# Altium project ((Inventory)).PrjPcb (part 3 of 4)

## Sheet Resistor - 681-816.SchDoc
size A0; SheetNumber: 12; SheetTotal: 41
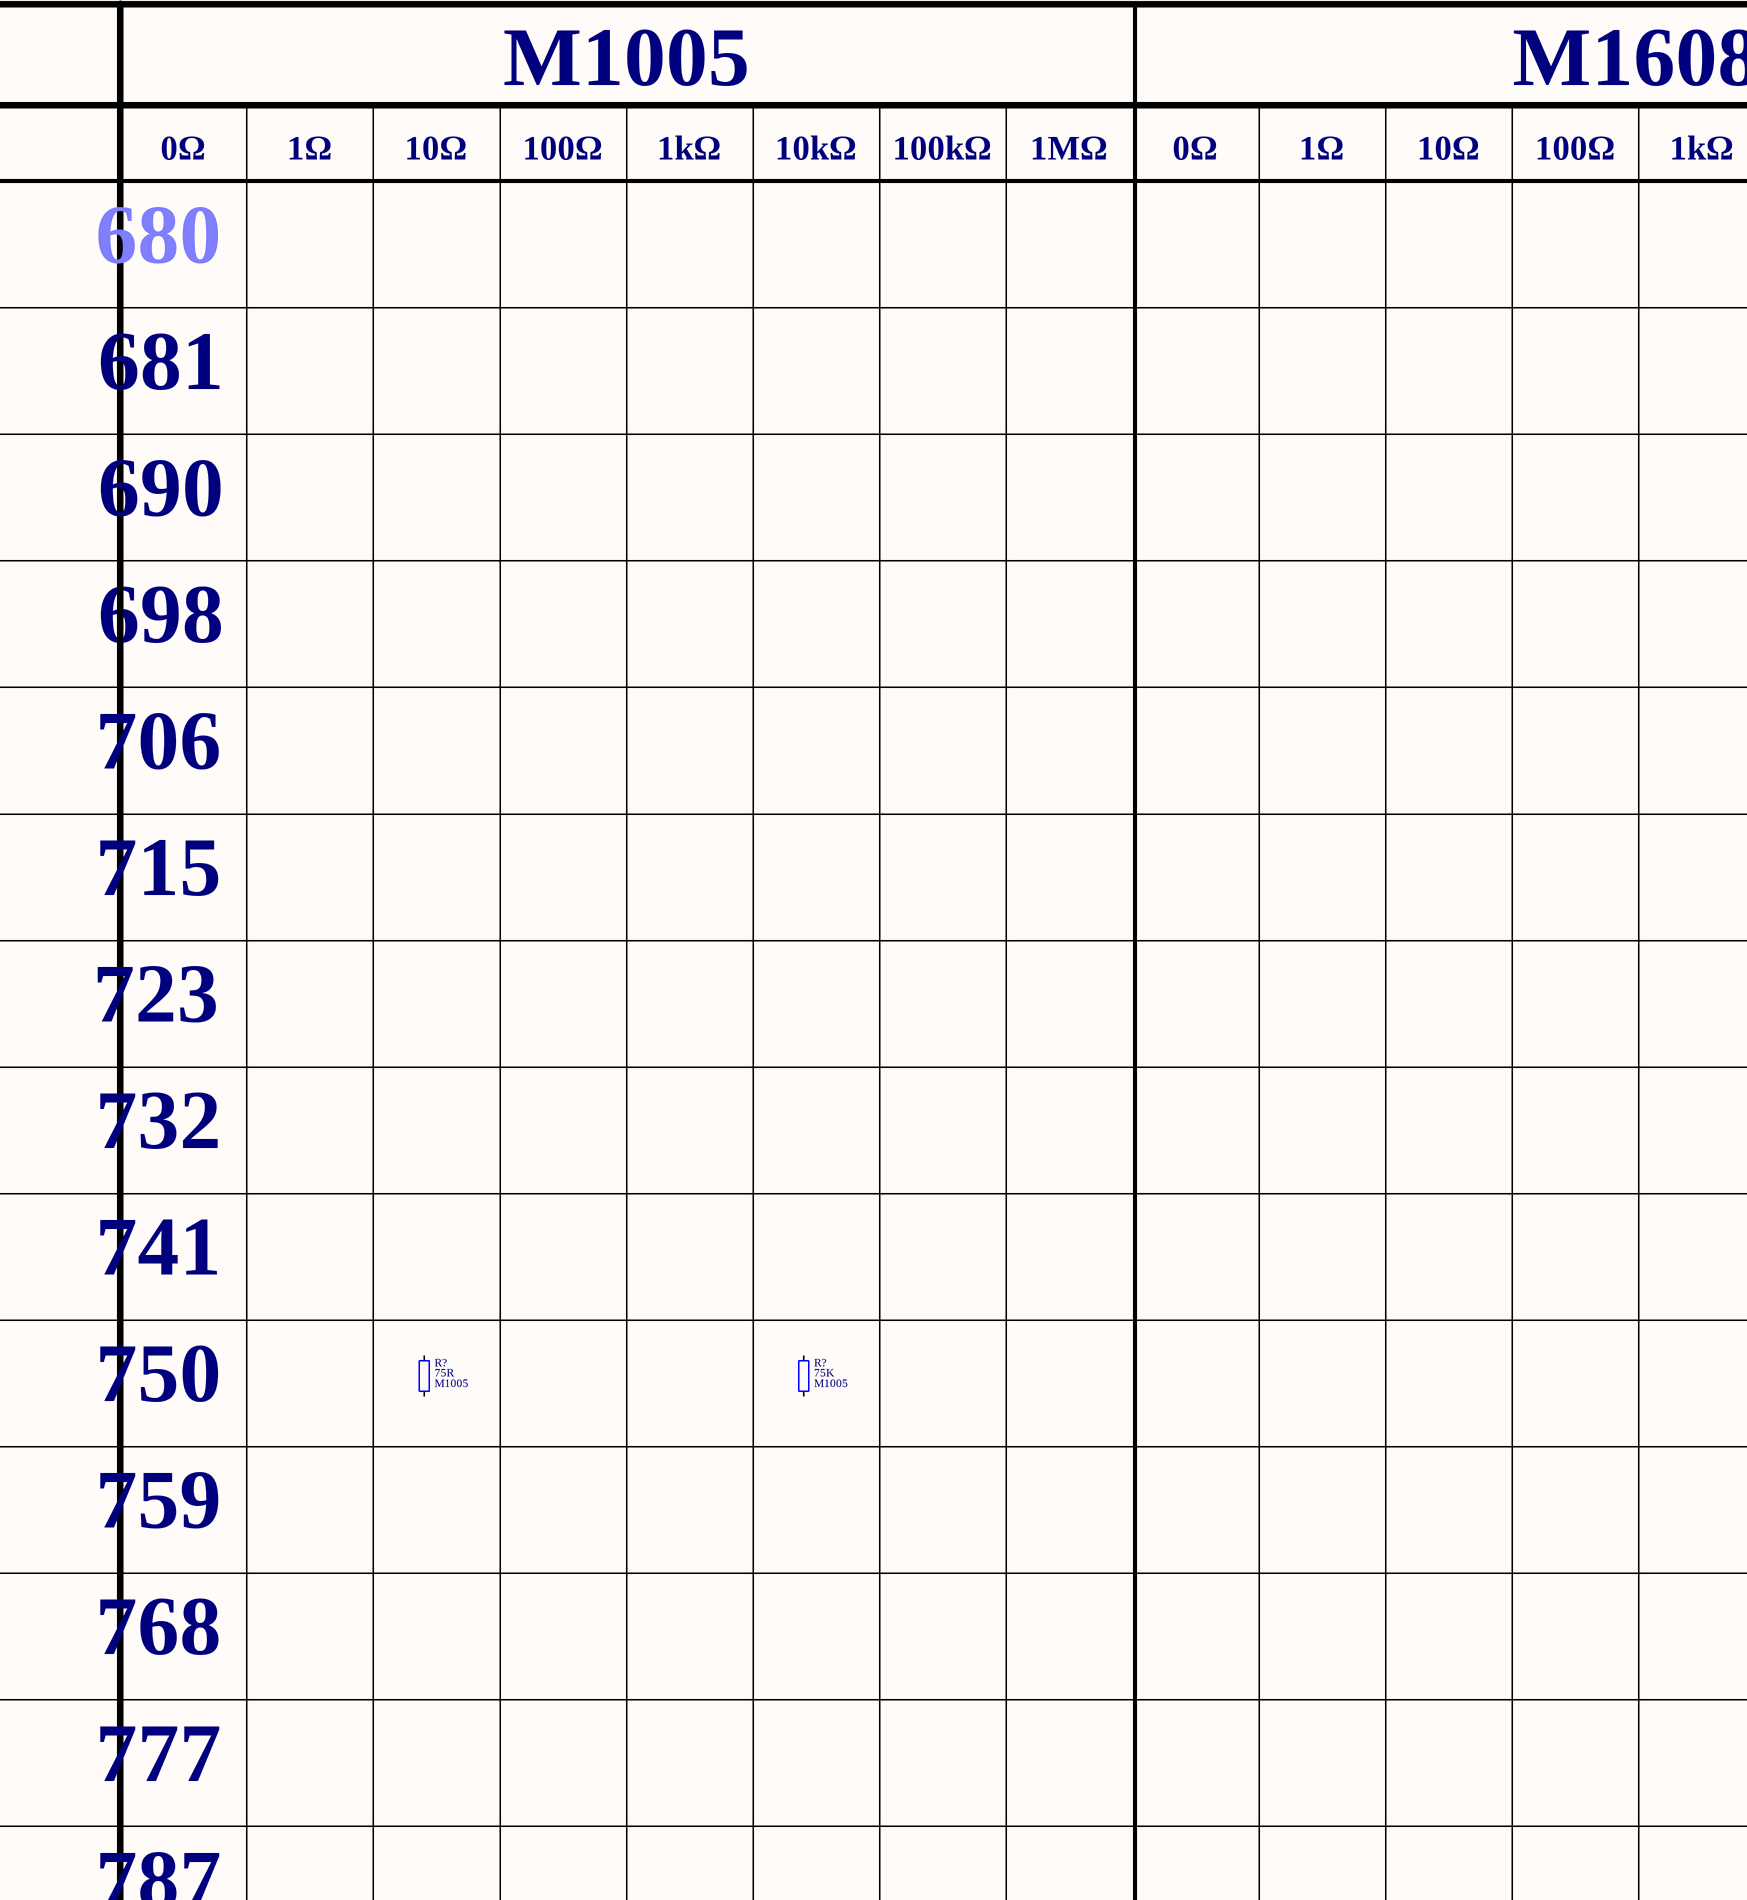
[diagram p41: Resistor - 681-816.SchDoc, top left]
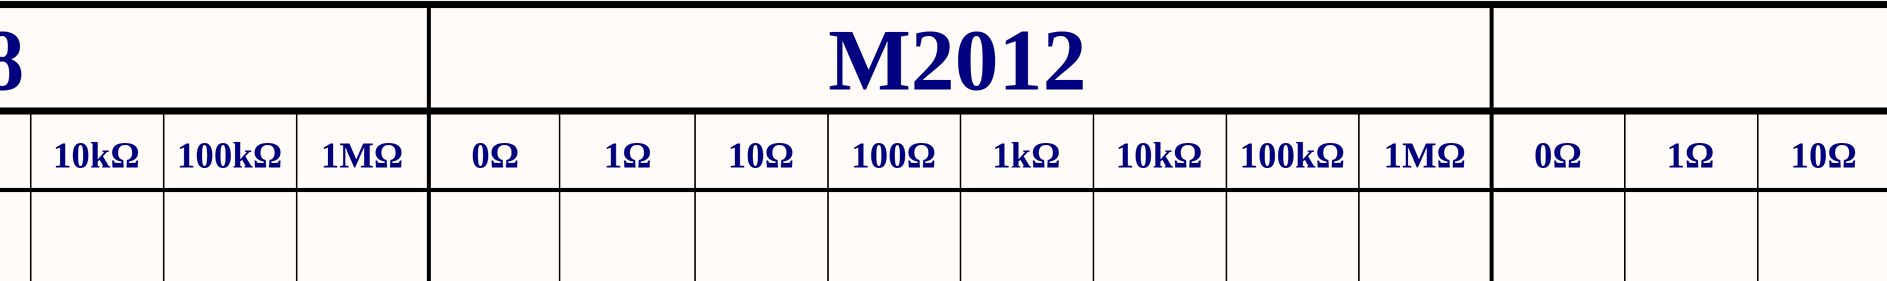
[diagram p42: Resistor - 681-816.SchDoc, top middle]
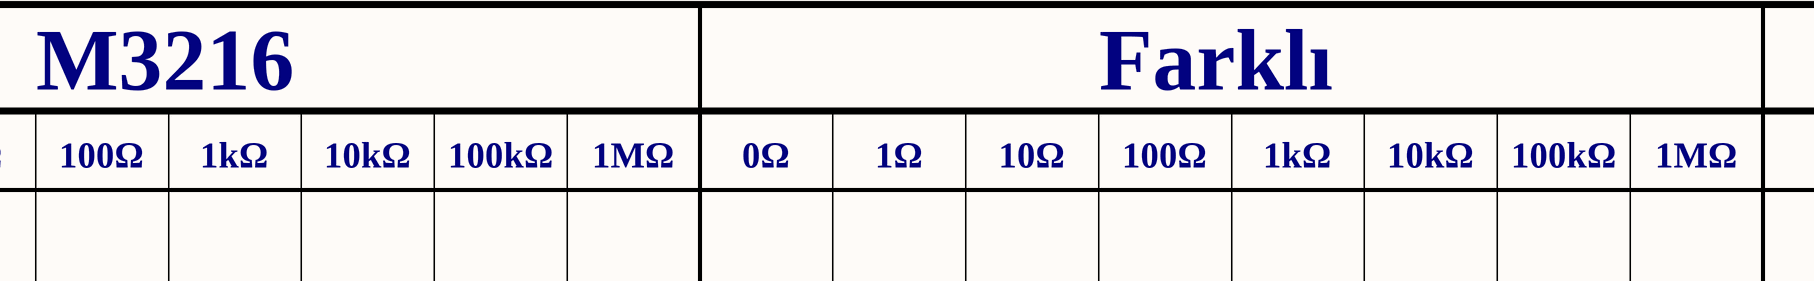
[diagram p43: Resistor - 681-816.SchDoc, top right]
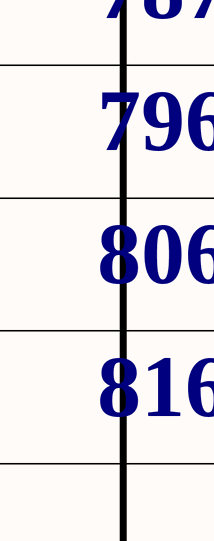
[diagram p44: Resistor - 681-816.SchDoc, bottom left]

### Parts
(Parts that share a designator on the sheet are numbered #1, #2 ... from top to bottom, then left to right.)
R?#18  value 75R  Package: M1005  [Resistor_Smd_M1005_I0402]  (hidden comment: Resistor)
R?#19  value 75K  Package: M1005  [Resistor_Smd_M1005_I0402]  (hidden comment: Resistor)

### Nets

Not connected (* = marked no-connect by the designer): R?#18 1 2; R?#19 1 2

### Notes on the sheet
- M1005
- M1608
- M2012
- M3216
- Farklı
- 0Ω
- 1Ω
- 10Ω
- 100Ω
- 1kΩ
- 10kΩ
- 100kΩ
- 1MΩ
- 680
- 681
- 690
- 698
- 706
- 715
- 723
- 732
- 741
- 750
- 759
- 768
- 777
- 787
- 796
- 806
- 816

### Library data of the parts
R?#18 = Resistor: Res, 75R, 1%, M1005; Manufacturer: Yageo; Manufacturer Part Number: RC0402FR-0775RL; Component Category: Resistor; Component Type: Fixed Value; Tolerance: 1%; Supplier Link: https://www.digikey.com/en/products/detail/yageo/RC0402FR-0775RL/726658; Supplier Currency: $; Price, Max: 0.00129; Price, Min: 0.1; Quantity, Max: 100000; Quantity, Min: 1; Operating Temperature, Max: -55℃; Operating Temperature, Min: +155℃; Supplier Part Number: 311-75.0LRCT-ND; Supplier: Digikey; ComponentLink1Description: Datasheet; ComponentLink1URL: E:\Altium\Datasheets\Resistor\Yageo - RC_L Series.pdf; ComponentLink2Description: Supplier Link; ComponentLink2URL: https://www.digikey.com/en/products/detail/yageo/RC0402FR-0775RL/726658
R?#19 = Resistor: Res, 75K, 1%, M1005; Manufacturer: Yageo; Manufacturer Part Number: RC0402FR-0775KL; Component Category: Resistor; Component Type: Fixed Value; Tolerance: 1%; Supplier Link: https://www.digikey.com/en/products/detail/yageo/RC0402FR-0775KL/2827576; Supplier Currency: $; Price, Max: 0.00129; Price, Min: 0.1; Quantity, Max: 100000; Quantity, Min: 1; Operating Temperature, Max: -55℃; Operating Temperature, Min: +155℃; Supplier Part Number: 311-75KLRCT-ND; Supplier: Digikey; ComponentLink1Description: Datasheet; ComponentLink1URL: E:\Altium\Datasheets\Resistor\Yageo - RC_L Series.pdf; ComponentLink2Description: Supplier Link; ComponentLink2URL: https://www.digikey.com/en/products/detail/yageo/RC0402FR-0775KL/2827576

## Sheet Resistor - 825-988.SchDoc
size A0; SheetNumber: 13; SheetTotal: 14
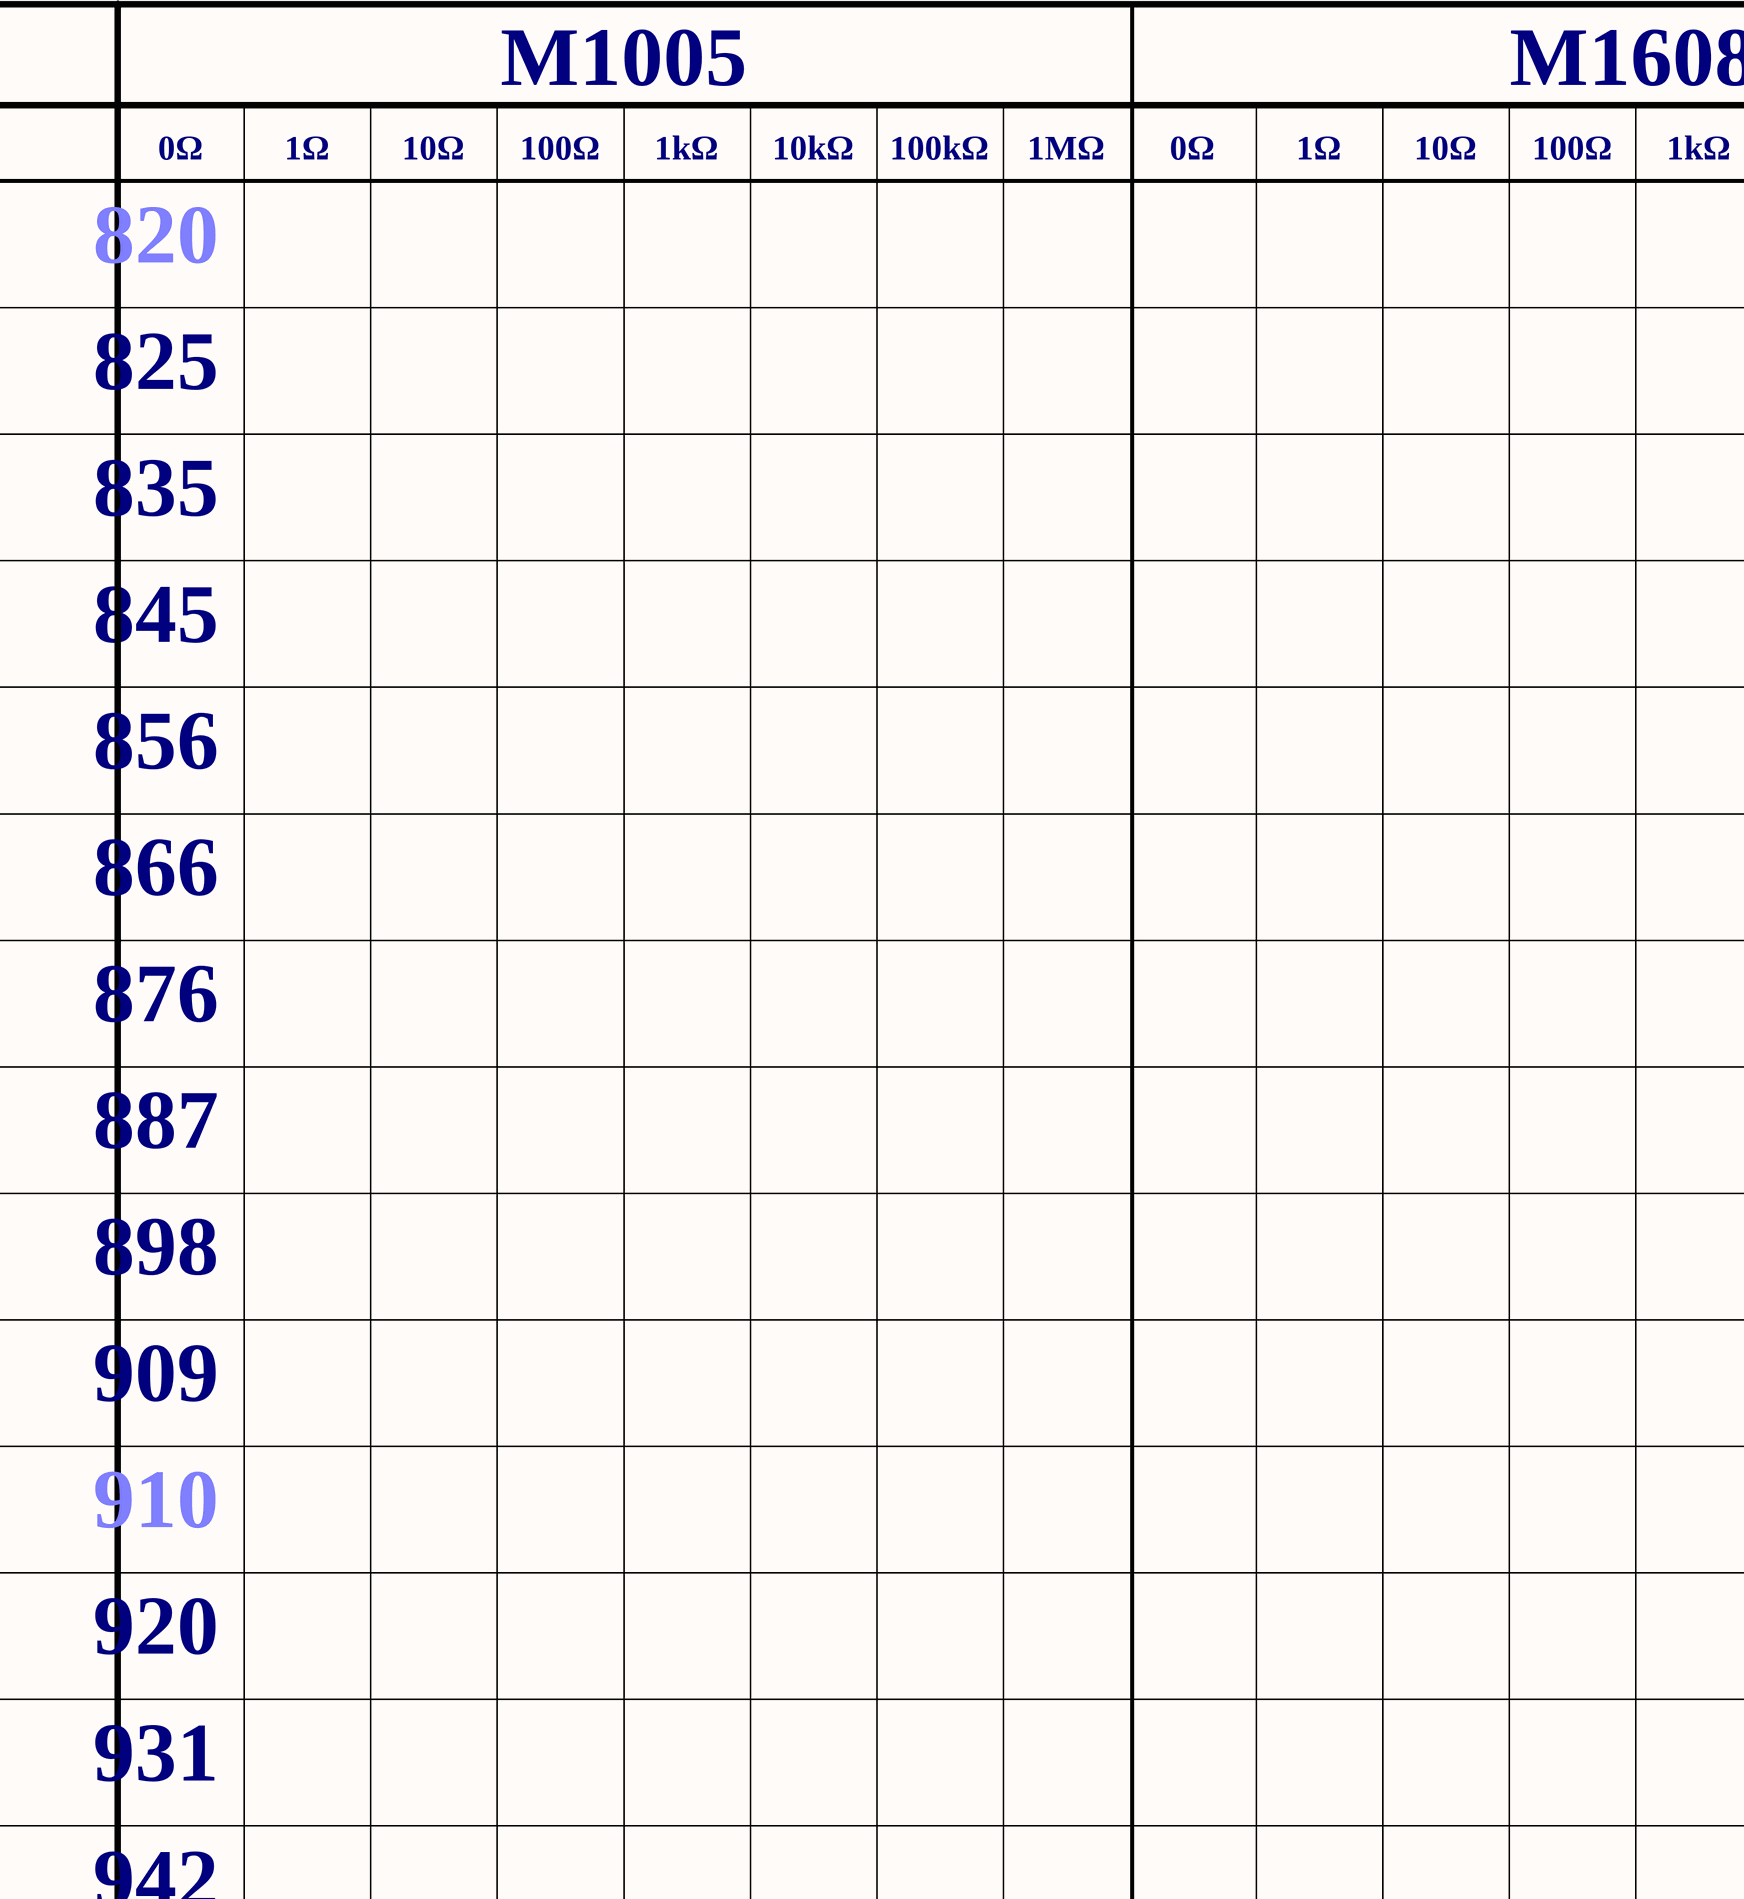
[diagram p45: Resistor - 825-988.SchDoc, top left]
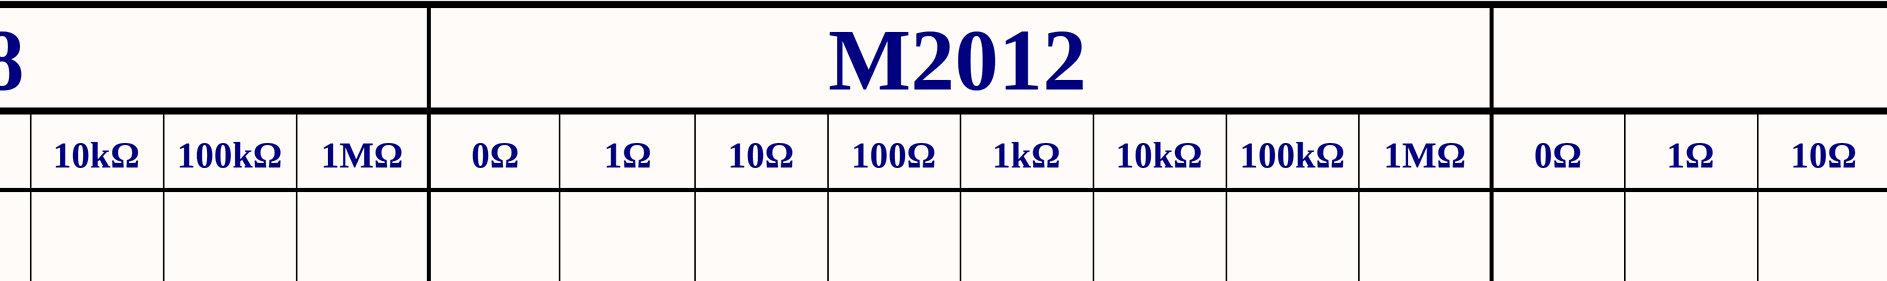
[diagram p46: Resistor - 825-988.SchDoc, top middle]
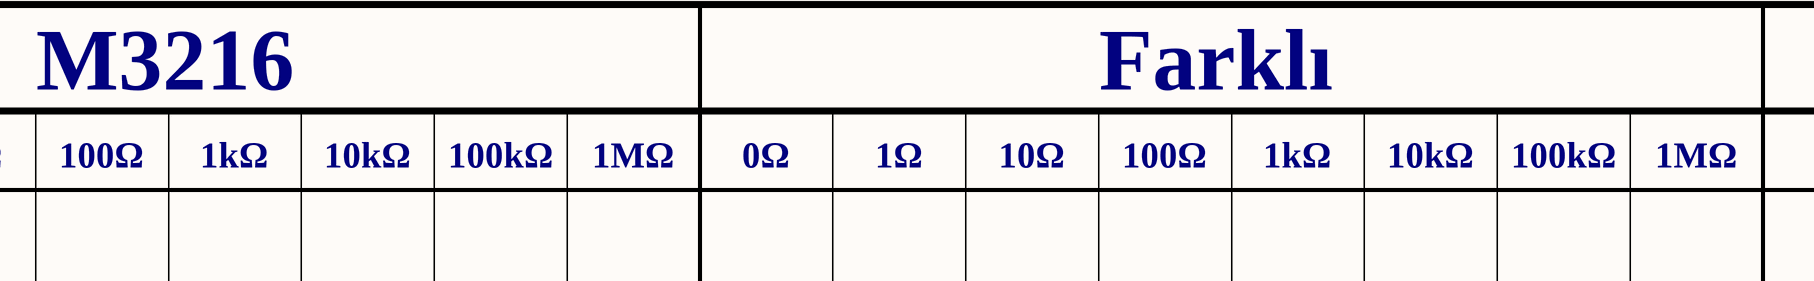
[diagram p47: Resistor - 825-988.SchDoc, top right]
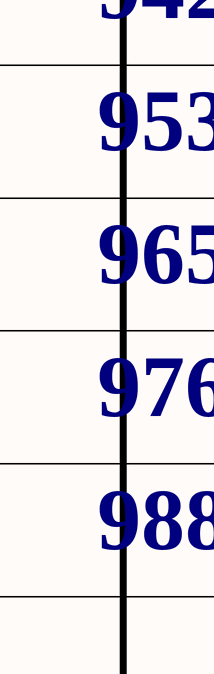
[diagram p48: Resistor - 825-988.SchDoc, bottom left]

### Notes on the sheet
- M1005
- M1608
- M2012
- M3216
- Farklı
- 0Ω
- 1Ω
- 10Ω
- 100Ω
- 1kΩ
- 10kΩ
- 100kΩ
- 1MΩ
- 820
- 825
- 835
- 845
- 856
- 866
- 876
- 887
- 898
- 909
- 910
- 920
- 931
- 942
- 953
- 965
- 976
- 988

## Sheet Resistor - Trim Pot.SchDoc
size A4; SheetNumber: 14; SheetTotal: 14

## Sheet Capacitor - Ceramic.SchDoc
size 1200 x 1200 mm; SheetNumber: 15; SheetTotal: 41
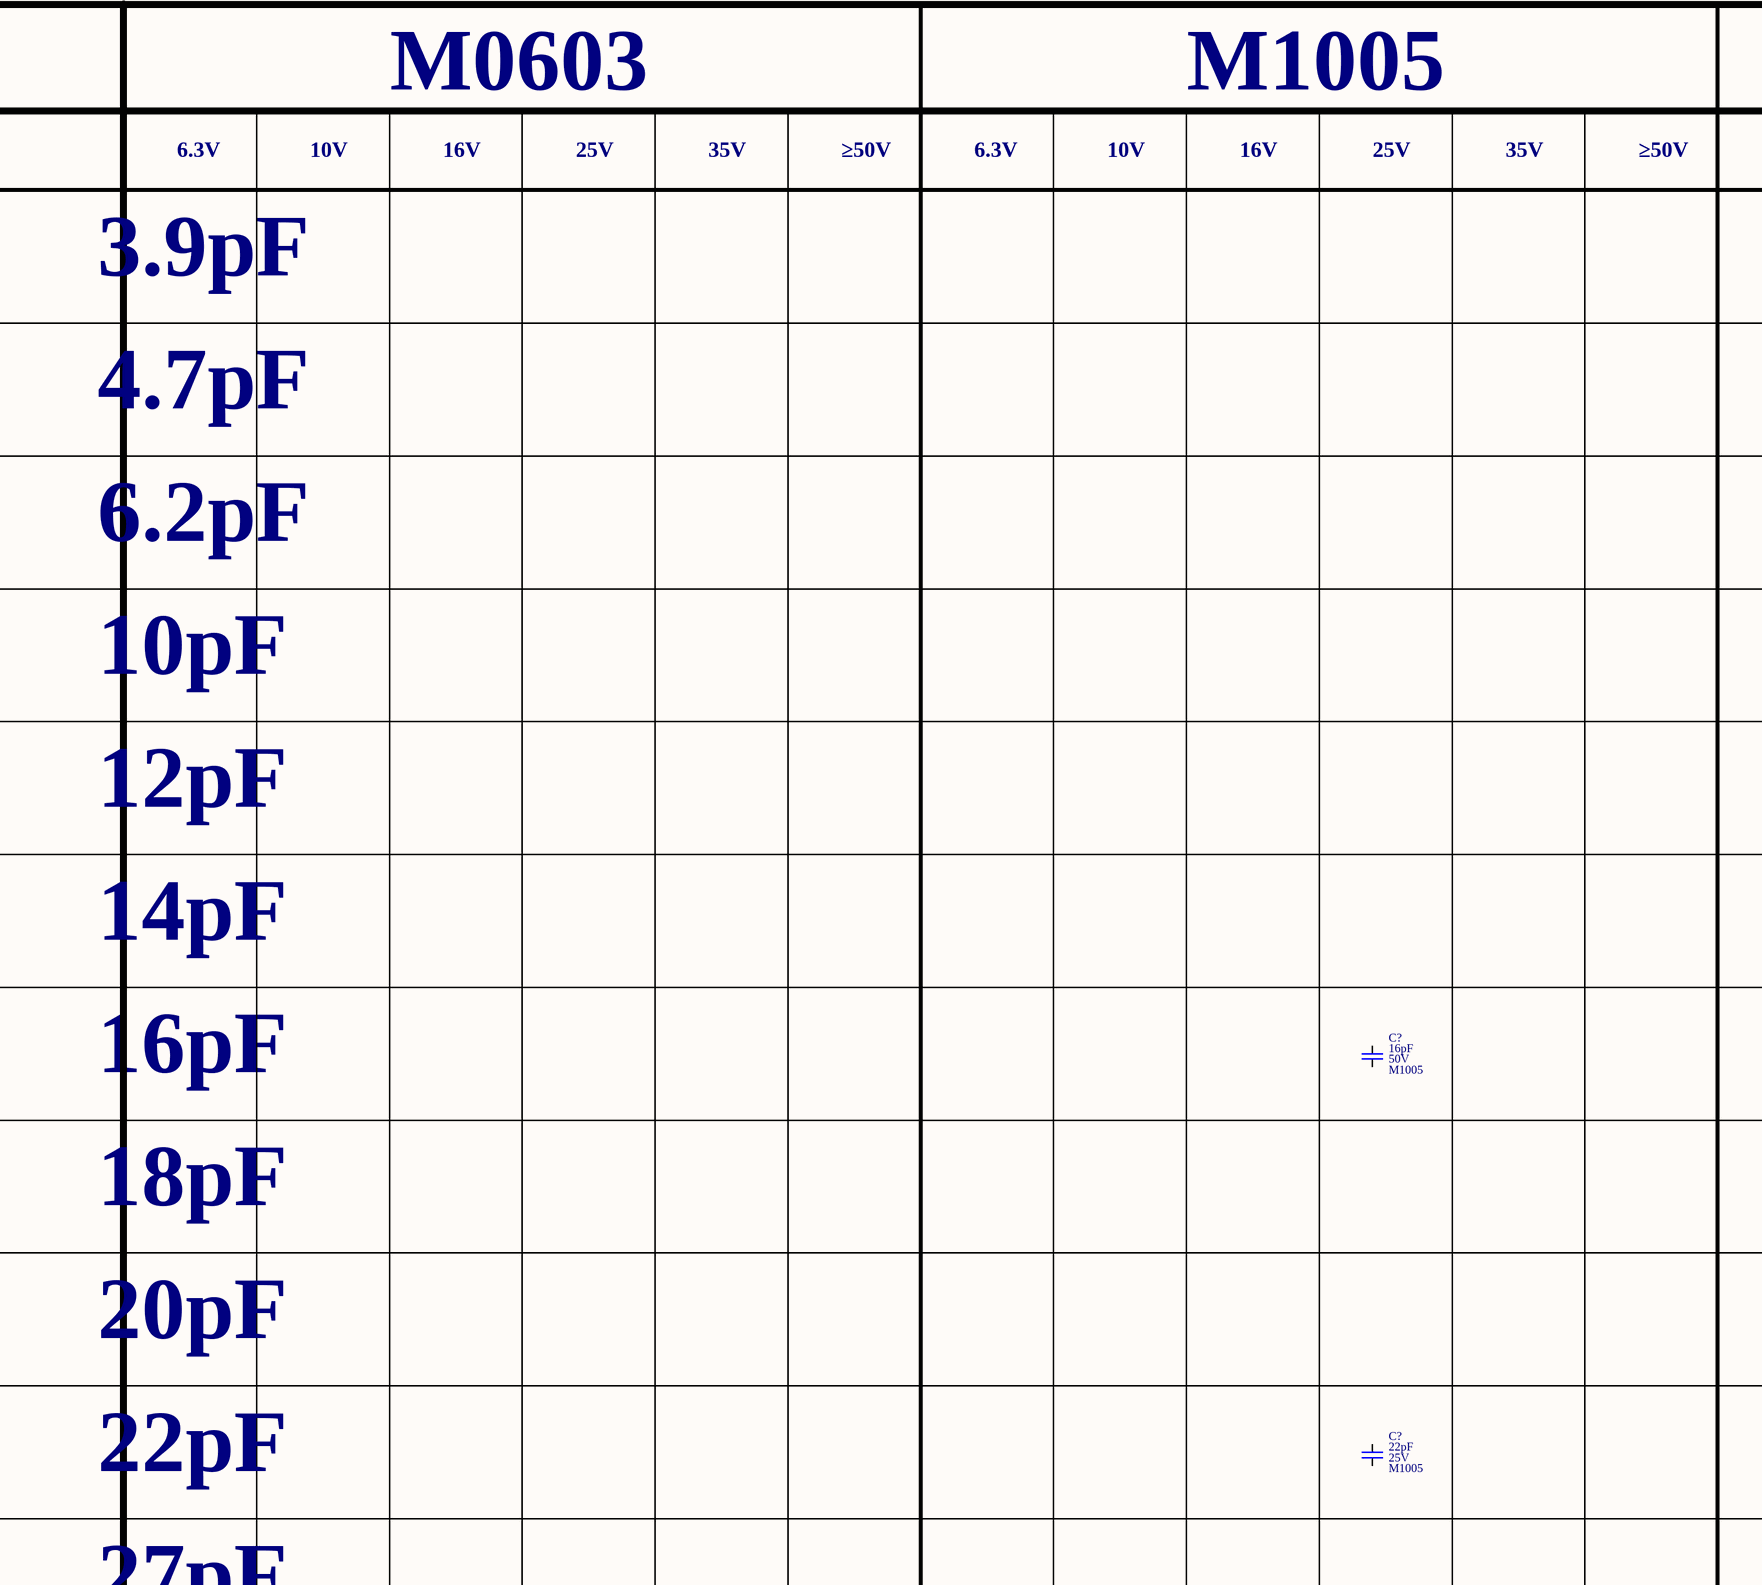
[diagram p49: Capacitor - Ceramic.SchDoc, row 1 of 4 left]
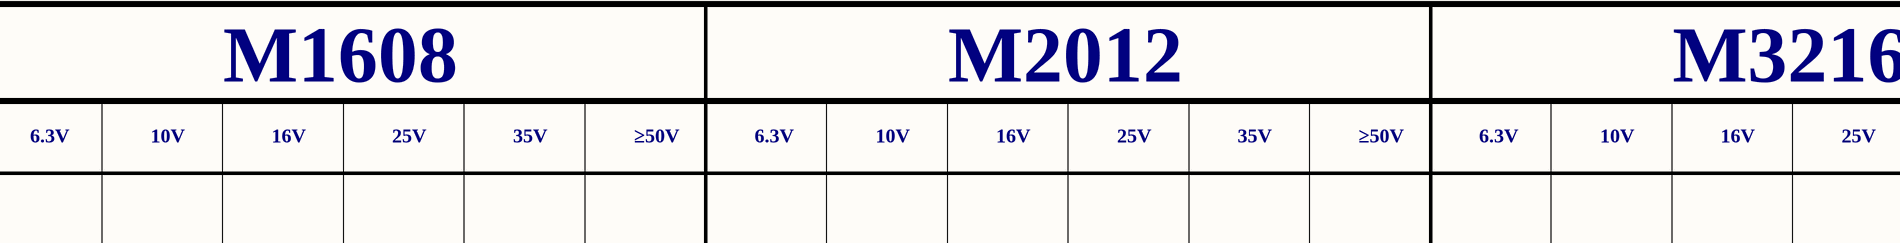
[diagram p50: Capacitor - Ceramic.SchDoc, row 1 of 4 middle]
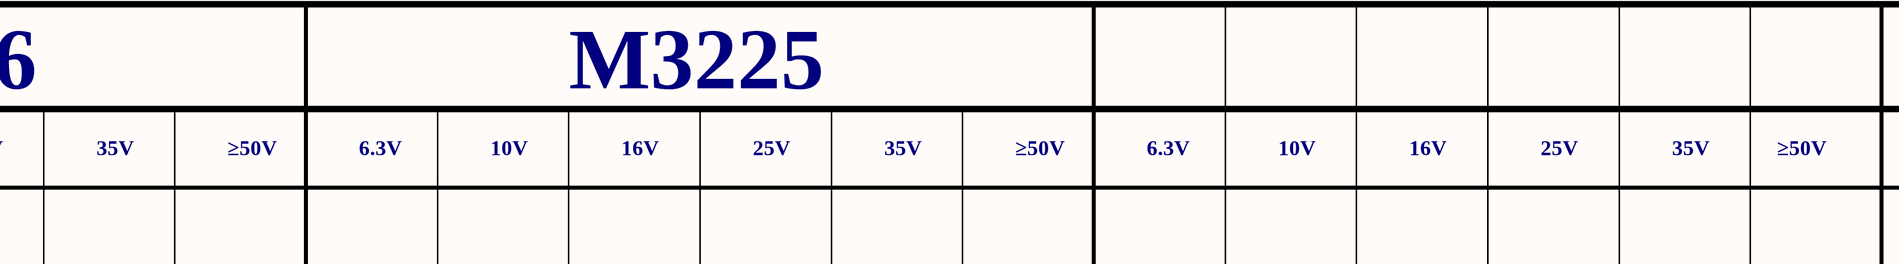
[diagram p51: Capacitor - Ceramic.SchDoc, row 1 of 4 right]
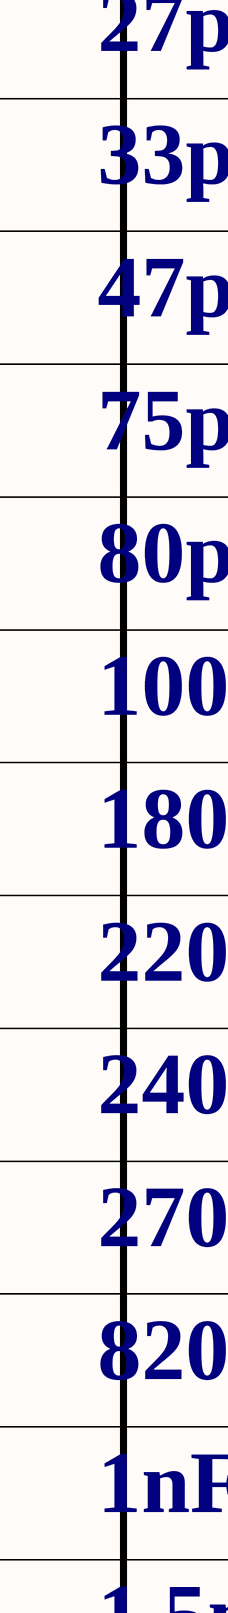
[diagram p52: Capacitor - Ceramic.SchDoc, row 2 of 4 left]
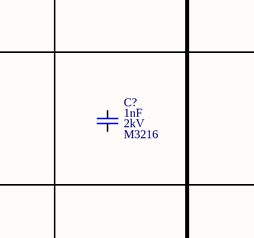
[diagram p53: Capacitor - Ceramic.SchDoc, row 2 of 4 right]
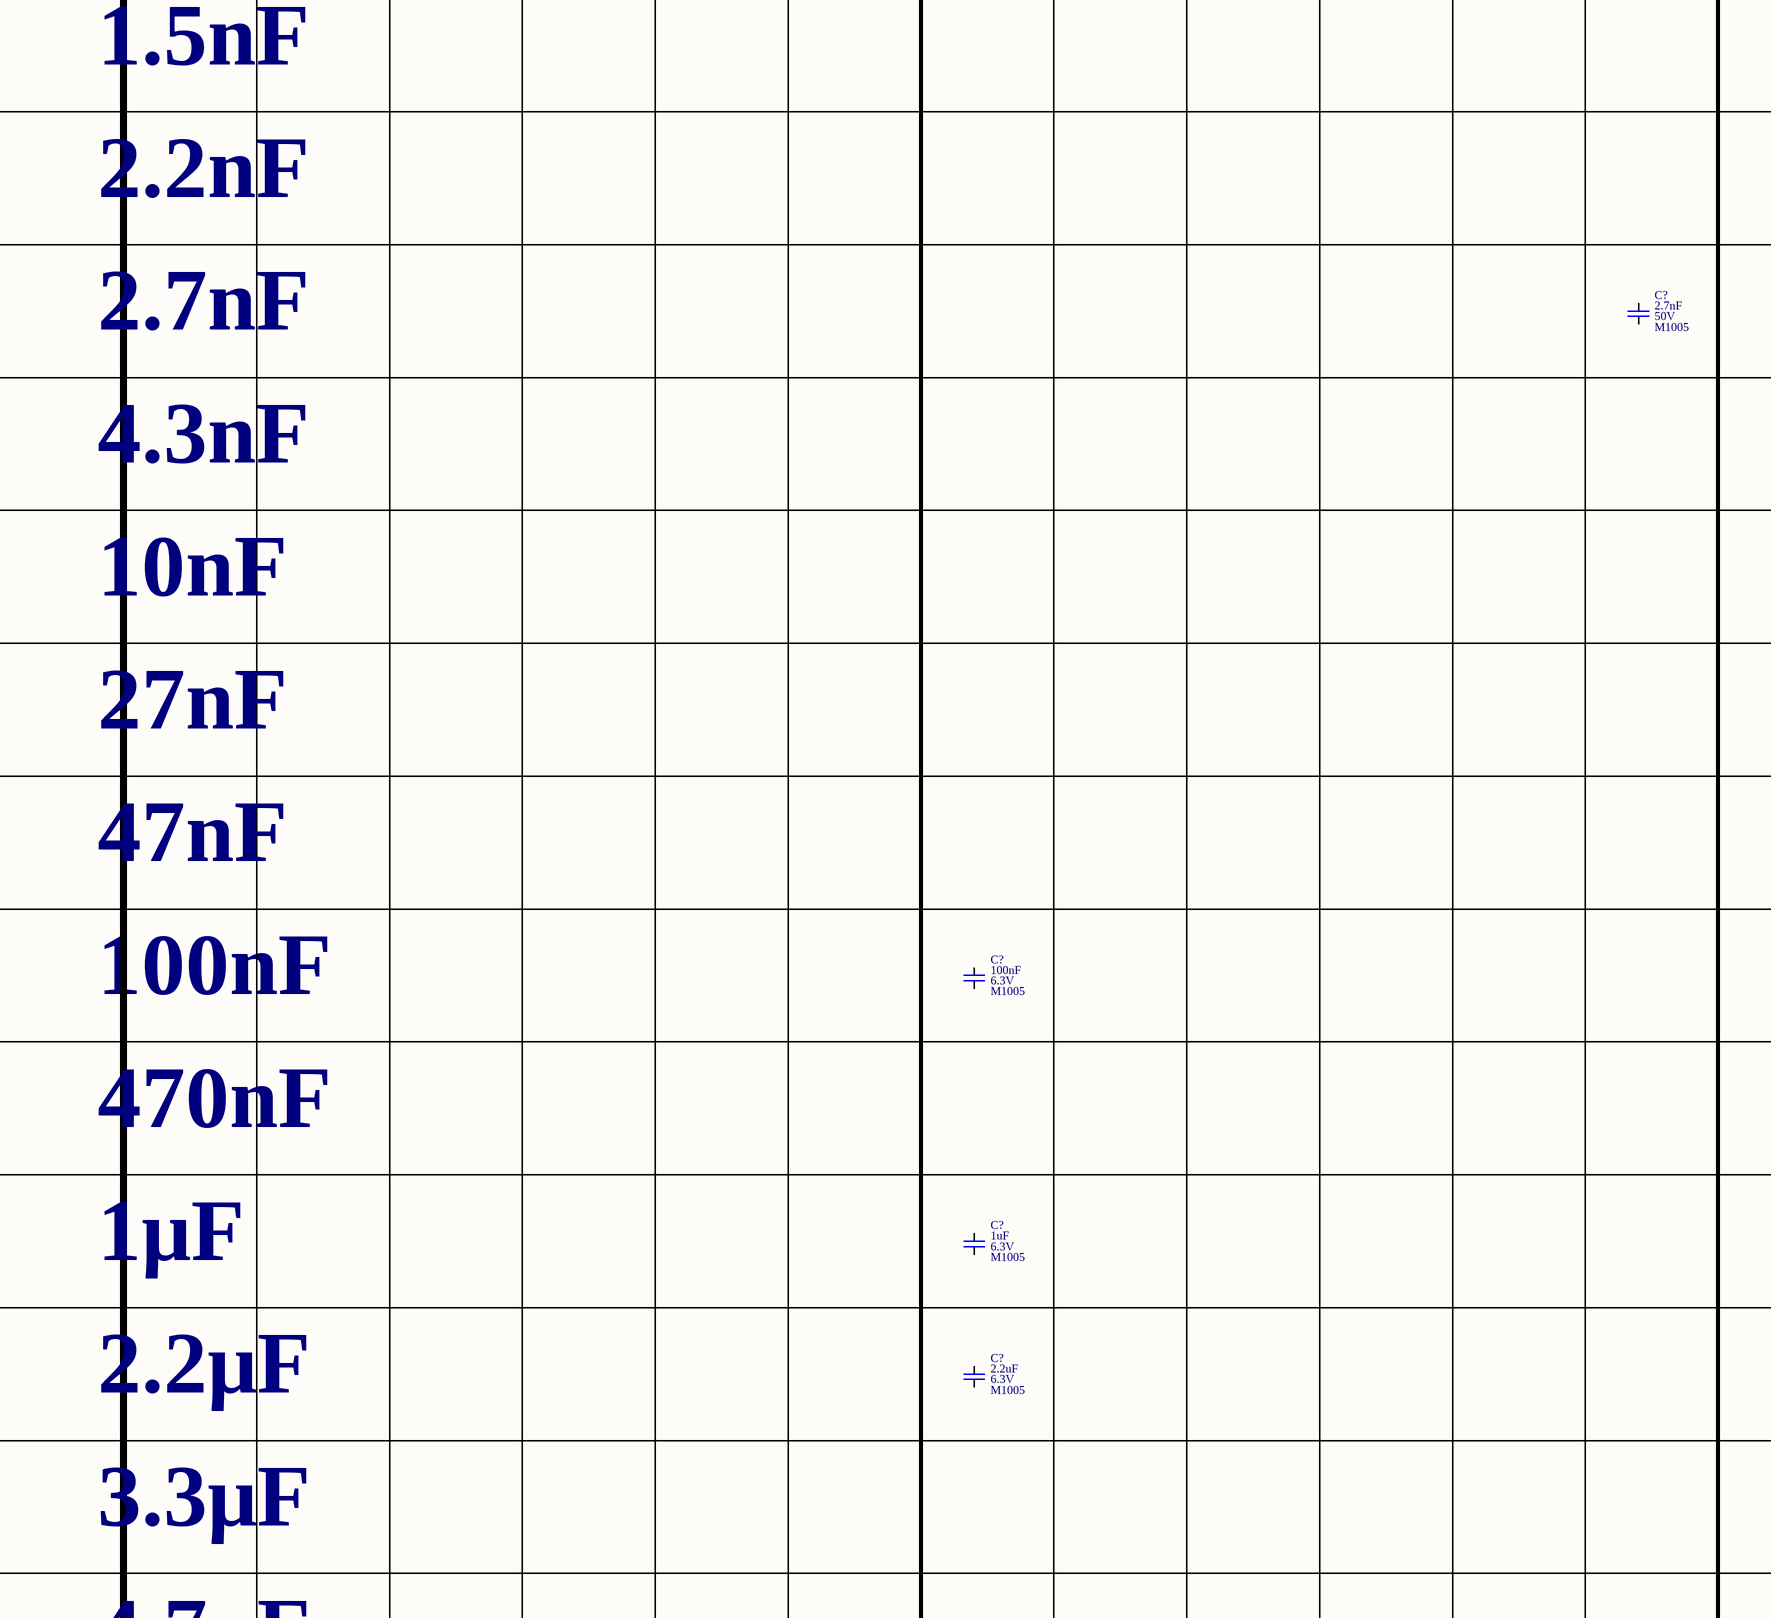
[diagram p54: Capacitor - Ceramic.SchDoc, row 3 of 4 left]
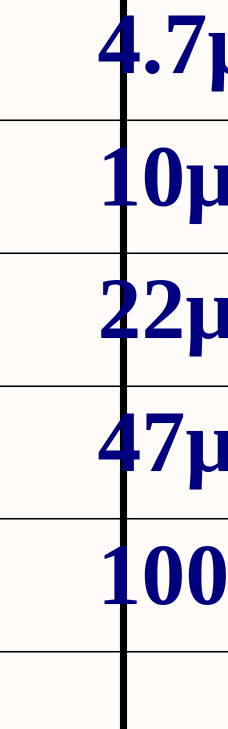
[diagram p55: Capacitor - Ceramic.SchDoc, row 4 of 4 left]
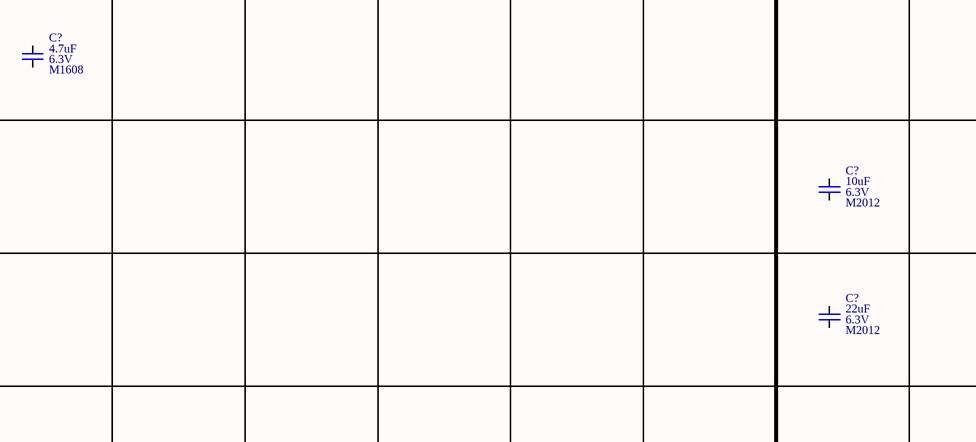
[diagram p56: Capacitor - Ceramic.SchDoc, row 4 of 4 middle]

### Parts
(Parts that share a designator on the sheet are numbered #1, #2 ... from top to bottom, then left to right.)
C?#1  value 16pF  Voltage: 50V  Package: M1005  [Capacitor_Ceramic_M1005_I0402]  (hidden comment: Capacitor_Ceramic)
C?#2  value 22pF  Voltage: 25V  Package: M1005  [Capacitor_Ceramic_M1005_I0402]  (hidden comment: Capacitor_Ceramic)
C?#3  value 1nF  Voltage: 2kV  Package: M3216  [Capacitor_Ceramic_M3216_I1206]  (hidden comment: Capacitor_Ceramic)
C?#4  value 2.7nF  Voltage: 50V  Package: M1005  [Capacitor_Ceramic_M1005_I0402]  (hidden comment: Capacitor_Ceramic)
C?#5  value 100nF  Voltage: 6.3V  Package: M1005  [Capacitor_Ceramic_M1005_I0402]  (hidden comment: Capacitor_Ceramic)
C?#6  value 1uF  Voltage: 6.3V  Package: M1005  [Capacitor_Ceramic_M1005_I0402]  (hidden comment: Capacitor_Ceramic)
C?#7  value 2.2uF  Voltage: 6.3V  Package: M1005  [Capacitor_Ceramic_M1005_I0402]  (hidden comment: Capacitor_Ceramic)
C?#8  value 4.7uF  Voltage: 6.3V  Package: M1608  [Capacitor_Ceramic_M1608_I0603]  (hidden comment: Capacitor_Ceramic)
C?#9  value 10uF  Voltage: 6.3V  Package: M2012  [Capacitor_Ceramic_M2012_I0805]  (hidden comment: Capacitor_Ceramic)
C?#10  value 22uF  Voltage: 6.3V  Package: M2012  [Capacitor_Ceramic_M2012_I0805]  (hidden comment: Capacitor_Ceramic)

### Nets

Not connected (* = marked no-connect by the designer): C?#1 1 2; C?#2 1 2; C?#3 1 2; C?#4 1 2; C?#5 1 2; C?#6 1 2; C?#7 1 2; C?#8 1 2; C?#9 1 2; C?#10 1 2

### Notes on the sheet
- M0603
- M1005
- M1608
- M2012
- M3216
- M3225
- 6.3V
- 10V
- 16V
- 25V
- 35V
- ≥50V
- 3.9pF
- 4.7pF
- 6.2pF
- 10pF
- 12pF
- 14pF
- 16pF
- 18pF
- 20pF
- 22pF
- 27pF
- 33pF
- 47pF
- 75pF
- 80pF
- 100pF
- 180pF
- 220pF
- 240pF
- 270pF
- 820pF
- 1nF
- 1.5nF
- 2.2nF
- 2.7nF
- 4.3nF
- 10nF
- 27nF
- 47nF
- 100nF
- 470nF
- 1μF
- 2.2μF
- 3.3μF
- 4.7μF
- 10μF
- 22μF
- 47μF
- 100μF

### Library data of the parts
C?#1 = Capacitor_Ceramic: Cap, Cer, 16pF, 50V, M1005; Manufacturer Part Number: 0402N160J500CT; Manufacturer: Walsin; Temperature Coefficient: C0G, NP0; Tolerance: 5%; ComponentLink1Description: Datasheet; ComponentLink1URL: E:\Altium\Datasheets\Capacitor\Walsin - Multilayer Ceramic Capacitors.pdf; ComponentLink2Description: Supplier Link; ComponentLink2URL: https://www.digikey.com/en/products/detail/walsin-technology-corporation/0402N160J500CT/9354759; Supplier: Digikey; Supplier Part Number: 1292-1262-1-ND; Operating Temperature, Min: +125℃; Operating Temperature, Max: -55℃; Quantity, Min: 1; Quantity, Max: 250000; Price, Min: 0.1; Supplier Currency: $; Price, Max: 0.00417; Supplier Link: https://www.digikey.com/en/products/detail/walsin-technology-corporation/0402N160J500CT/9354759; Component Type: Ceramic; Component Category: Capacitor
C?#2 = Capacitor_Ceramic: Cap, Cer, 22pF, 25V, M1005; Manufacturer Part Number: 0402N220J250CT; Manufacturer: Walsin; Temperature Coefficient: C0G, NP0; Tolerance: 5%; ComponentLink1Description: Datasheet; ComponentLink1URL: E:\Altium\Datasheets\Capacitor\Walsin - Multilayer Ceramic Capacitors.pdf; ComponentLink2Description: Supplier Link; ComponentLink2URL: https://www.digikey.com/en/products/detail/walsin-technology-corporation/0402N220J250CT/9354779; Supplier: Digikey; Supplier Part Number: 1292-1282-1-ND; Operating Temperature, Min: +125℃; Operating Temperature, Max: -55℃; Quantity, Min: 1; Quantity, Max: 250000; Price, Min: 0.1; Supplier Currency: $; Price, Max: 0.00177; Supplier Link: https://www.digikey.com/en/products/detail/walsin-technology-corporation/0402N220J250CT/9354779; Component Type: Ceramic; Component Category: Capacitor
C?#3 = Capacitor_Ceramic: Cap, Cer, 1nF, 2kV, M3216; Manufacturer Part Number: CC1206MKX7RDBB102; Manufacturer: Yageo; Temperature Coefficient: X7R; Tolerance: 20%; ComponentLink1Description: Datasheet; ComponentLink1URL: E:\Altium\Datasheets\Capacitor\Yageo - Surface-Mount Ceramic Multilayer Capacitors.pdf; ComponentLink2Description: Supplier Link; ComponentLink2URL: https://www.digikey.com/en/products/detail/yageo/CC1206MKX7RDBB102/5884663; Supplier: Digikey; Supplier Part Number: 311-4501-1-ND; Operating Temperature, Min: +125℃; Operating Temperature, Max: -55℃; Quantity, Min: 1; Quantity, Max: 300000; Price, Min: 0.23; Supplier Currency: $; Price, Max: 0.03271; Supplier Link: https://www.digikey.com/en/products/detail/yageo/CC1206MKX7RDBB102/5884663; Component Type: Ceramic; Component Category: Capacitor
C?#4 = Capacitor_Ceramic: Cap, Cer, 2.7nF, 50V, M1005; Manufacturer Part Number: CC0402KRX7R9BB272; Manufacturer: Yageo; Temperature Coefficient: X7R; Tolerance: 10%; ComponentLink1Description: Datasheet; ComponentLink1URL: E:\Altium\Datasheets\Capacitor\Yageo - Surface-Mount Ceramic Multilayer Capacitors.pdf; ComponentLink2Description: Supplier Link; ComponentLink2URL: https://www.digikey.com/en/products/detail/yageo/CC0402KRX7R9BB272/302767; Supplier: Digikey; Supplier Part Number: 311-1033-1-ND; Operating Temperature, Min: +125℃; Operating Temperature, Max: -55℃; Quantity, Min: 1; Quantity, Max: 250000; Price, Min: 0.1; Supplier Currency: $; Price, Max: 0.00278; Supplier Link: https://www.digikey.com/en/products/detail/yageo/CC0402KRX7R9BB272/302767; Component Type: Ceramic; Component Category: Capacitor
C?#5 = Capacitor_Ceramic: Cap, Cer, 100nF, 6.3V, M1005; Manufacturer Part Number: 04026D104KAT4A; Manufacturer: Kyocera; Temperature Coefficient: X5R; Tolerance: 10%; ComponentLink1Description: Datasheet; ComponentLink1URL: E:\Altium\Datasheets\Capacitor\Kyocera - X5R.pdf; ComponentLink2Description: Supplier Link; ComponentLink2URL: https://www.digikey.com/en/products/detail/kyocera-avx/04026D104KAT4A/8107673; Supplier: Digikey; Supplier Part Number: 478-11504-1-ND; Operating Temperature, Min: +85℃; Operating Temperature, Max: -55℃; Quantity, Min: 1; Quantity, Max: 250000; Price, Min: 0.1; Supplier Currency: $; Price, Max: 0.00189; Supplier Link: https://www.digikey.com/en/products/detail/kyocera-avx/04026D104KAT4A/8107673; Component Type: Ceramic; Component Category: Capacitor
C?#6 = Capacitor_Ceramic: Cap, Cer, 1uF, 6.3V, M1005; Manufacturer Part Number: CL05A105MQ5NNNC; Manufacturer: Samsung; Temperature Coefficient: X5R; Tolerance: 20%; ComponentLink1Description: Datasheet; ComponentLink1URL: E:\Altium\Datasheets\Capacitor\Samsung - Multi Layer Ceramic Capacitors.pdf; ComponentLink2Description: Supplier Link; ComponentLink2URL: https://www.digikey.com/en/products/detail/samsung-electro-mechanics/CL05A105MQ5NNNC/3886893; Supplier: Digikey; Supplier Part Number: 1276-1235-1-ND; Operating Temperature, Min: +85℃; Operating Temperature, Max: -55℃; Quantity, Min: 1; Quantity, Max: 250000; Price, Min: 0.1; Supplier Currency: $; Price, Max: 0.00144; Supplier Link: https://www.digikey.com/en/products/detail/samsung-electro-mechanics/CL05A105MQ5NNNC/3886893; Component Type: Ceramic; Component Category: Capacitor
C?#7 = Capacitor_Ceramic: Cap, Cer, 2.2uF, 6.3V, M1005; Manufacturer Part Number: CL05A225MQ5NNNC; Manufacturer: Samsung; Temperature Coefficient: X5R; Tolerance: 20%; ComponentLink1Description: Datasheet; ComponentLink1URL: E:\Altium\Datasheets\Capacitor\Samsung - Multi Layer Ceramic Capacitors.pdf; ComponentLink2Description: Supplier Link; ComponentLink2URL: https://www.digikey.com/en/products/detail/samsung-electro-mechanics/CL05A225MQ5NNNC/3887127; Supplier: Digikey; Supplier Part Number: 1276-1469-1-ND; Operating Temperature, Min: +85℃; Operating Temperature, Max: -55℃; Quantity, Min: 1; Quantity, Max: 250000; Price, Min: 0.1; Supplier Currency: $; Price, Max: 0.00244; Supplier Link: https://www.digikey.com/en/products/detail/samsung-electro-mechanics/CL05A225MQ5NNNC/3887127; Component Type: Ceramic; Component Category: Capacitor
C?#8 = Capacitor_Ceramic: Cap, Cer, 4.7uF, 6.3V, M1608; Manufacturer Part Number: CL10A475KQ8NNNC; Manufacturer: Samsung; Temperature Coefficient: X5R; Tolerance: 10%; ComponentLink1Description: Datasheet; ComponentLink1URL: E:\Altium\Datasheets\Capacitor\Samsung - Multi Layer Ceramic Capacitors.pdf; ComponentLink2Description: Supplier Link; ComponentLink2URL: https://www.digikey.com/en/products/detail/samsung-electro-mechanics/CL10A475KQ8NNNC/3886703; Supplier: Digikey; Supplier Part Number: 1276-1045-1-ND; Operating Temperature, Min: +85℃; Operating Temperature, Max: -55℃; Quantity, Min: 1; Quantity, Max: 400000; Price, Min: 0.1; Supplier Currency: $; Price, Max: 0.00444; Supplier Link: https://www.digikey.com/en/products/detail/samsung-electro-mechanics/CL10A475KQ8NNNC/3886703; Component Type: Ceramic; Component Category: Capacitor
C?#9 = Capacitor_Ceramic: Cap, Cer, 10uF, 6.3V, M2012; Manufacturer Part Number: CL21A106MQFNNNE; Manufacturer: Samsung; Temperature Coefficient: X5R; Tolerance: 20%; ComponentLink1Description: Datasheet; ComponentLink1URL: E:\Altium\Datasheets\Capacitor\Samsung - Multi Layer Ceramic Capacitors.pdf; ComponentLink2Description: Supplier Link; ComponentLink2URL: https://www.digikey.com/en/products/detail/samsung-electro-mechanics/CL21A106MQFNNNE/3886956; Supplier: Digikey; Supplier Part Number: 1276-1298-1-ND; Operating Temperature, Min: +85℃; Operating Temperature, Max: -55℃; Quantity, Min: 1; Quantity, Max: 200000; Price, Min: 0.1; Supplier Currency: $; Price, Max: 0.0087; Supplier Link: https://www.digikey.com/en/products/detail/samsung-electro-mechanics/CL21A106MQFNNNE/3886956; Component Type: Ceramic; Component Category: Capacitor
C?#10 = Capacitor_Ceramic: Cap, Cer, 22uF, 6.3V, M2012; Manufacturer Part Number: GRM21BR60J226ME39K; Manufacturer: Murata; Temperature Coefficient: X5R; Tolerance: 20%; ComponentLink1Description: Datasheet; ComponentLink1URL: E:\Altium\Datasheets\Capacitor\Murata - Multilayer Ceramic Capacitors.pdf; ComponentLink2Description: Supplier Link; ComponentLink2URL: https://www.digikey.com/en/products/detail/murata-electronics/GRM21BR60J226ME39K/2546881; Supplier: Digikey; Supplier Part Number: 490-6471-1-ND; Operating Temperature, Min: +85℃; Operating Temperature, Max: -55℃; Quantity, Min: 1; Quantity, Max: 250000; Price, Min: 0.25; Supplier Currency: $; Price, Max: 0.02843; Supplier Link: https://www.digikey.com/en/products/detail/murata-electronics/GRM21BR60J226ME39K/2546881; Component Type: Ceramic; Component Category: Capacitor

## Sheet Diode.SchDoc
size A3; SheetNumber: 20; SheetTotal: 20
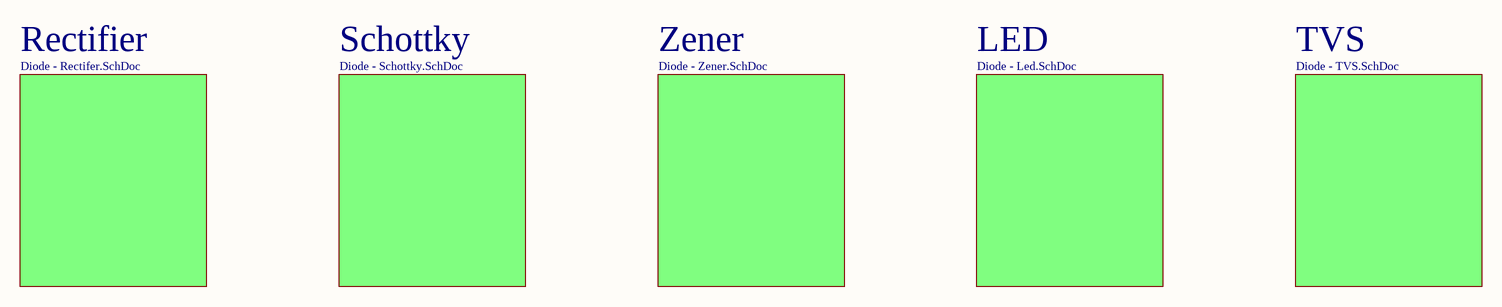
[diagram p57: Diode.SchDoc]

### Sub-sheets
LED = Diode - Led.SchDoc: no entries
Rectifier = Diode - Rectifer.SchDoc: no entries
Schottky = Diode - Schottky.SchDoc: no entries
TVS = Diode - TVS.SchDoc: no entries
Zener = Diode - Zener.SchDoc: no entries

## Sheet Diode - Rectifer.SchDoc
size A3; SheetNumber: 23; SheetTotal: 40
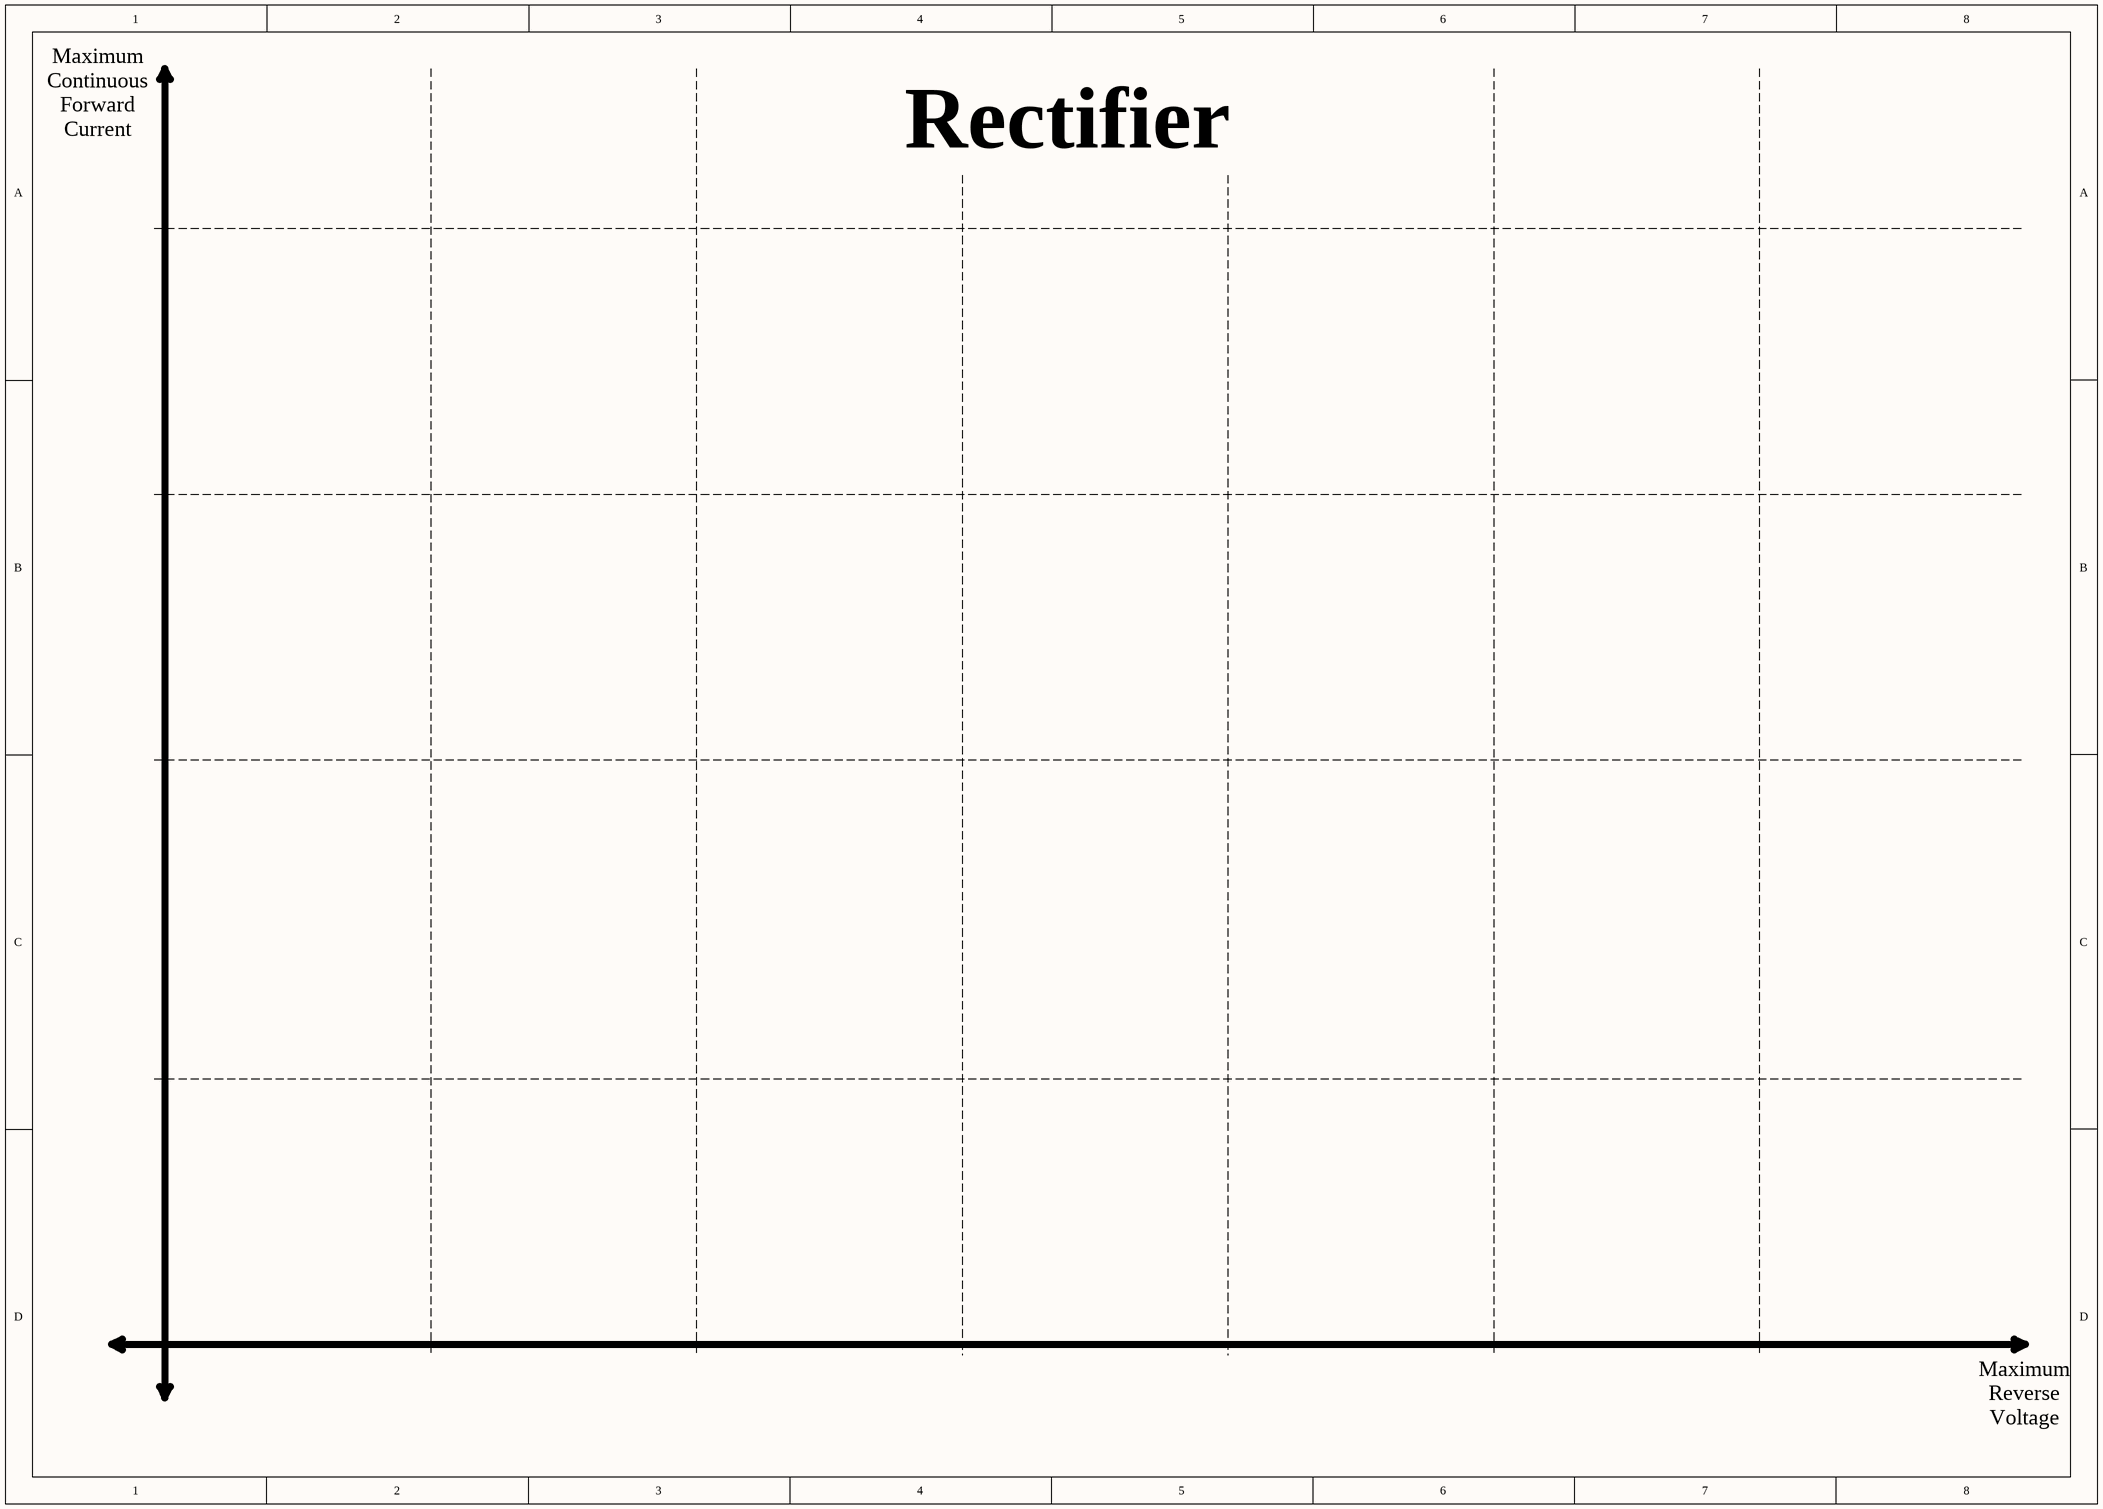
[diagram p58: Diode - Rectifer.SchDoc]

### Notes on the sheet
- Maximum
  Continuous
  Forward
  Current
- Rectifier
- 1000A
- 100A
- 10A
- 1A
- 50V
- 100V
- 200V
- 400V
- 800V
- 1600V
- Maximum
  Reverse
  Voltage

## Sheet Diode - Zener.SchDoc
size A3; SheetNumber: 20; SheetTotal: 20
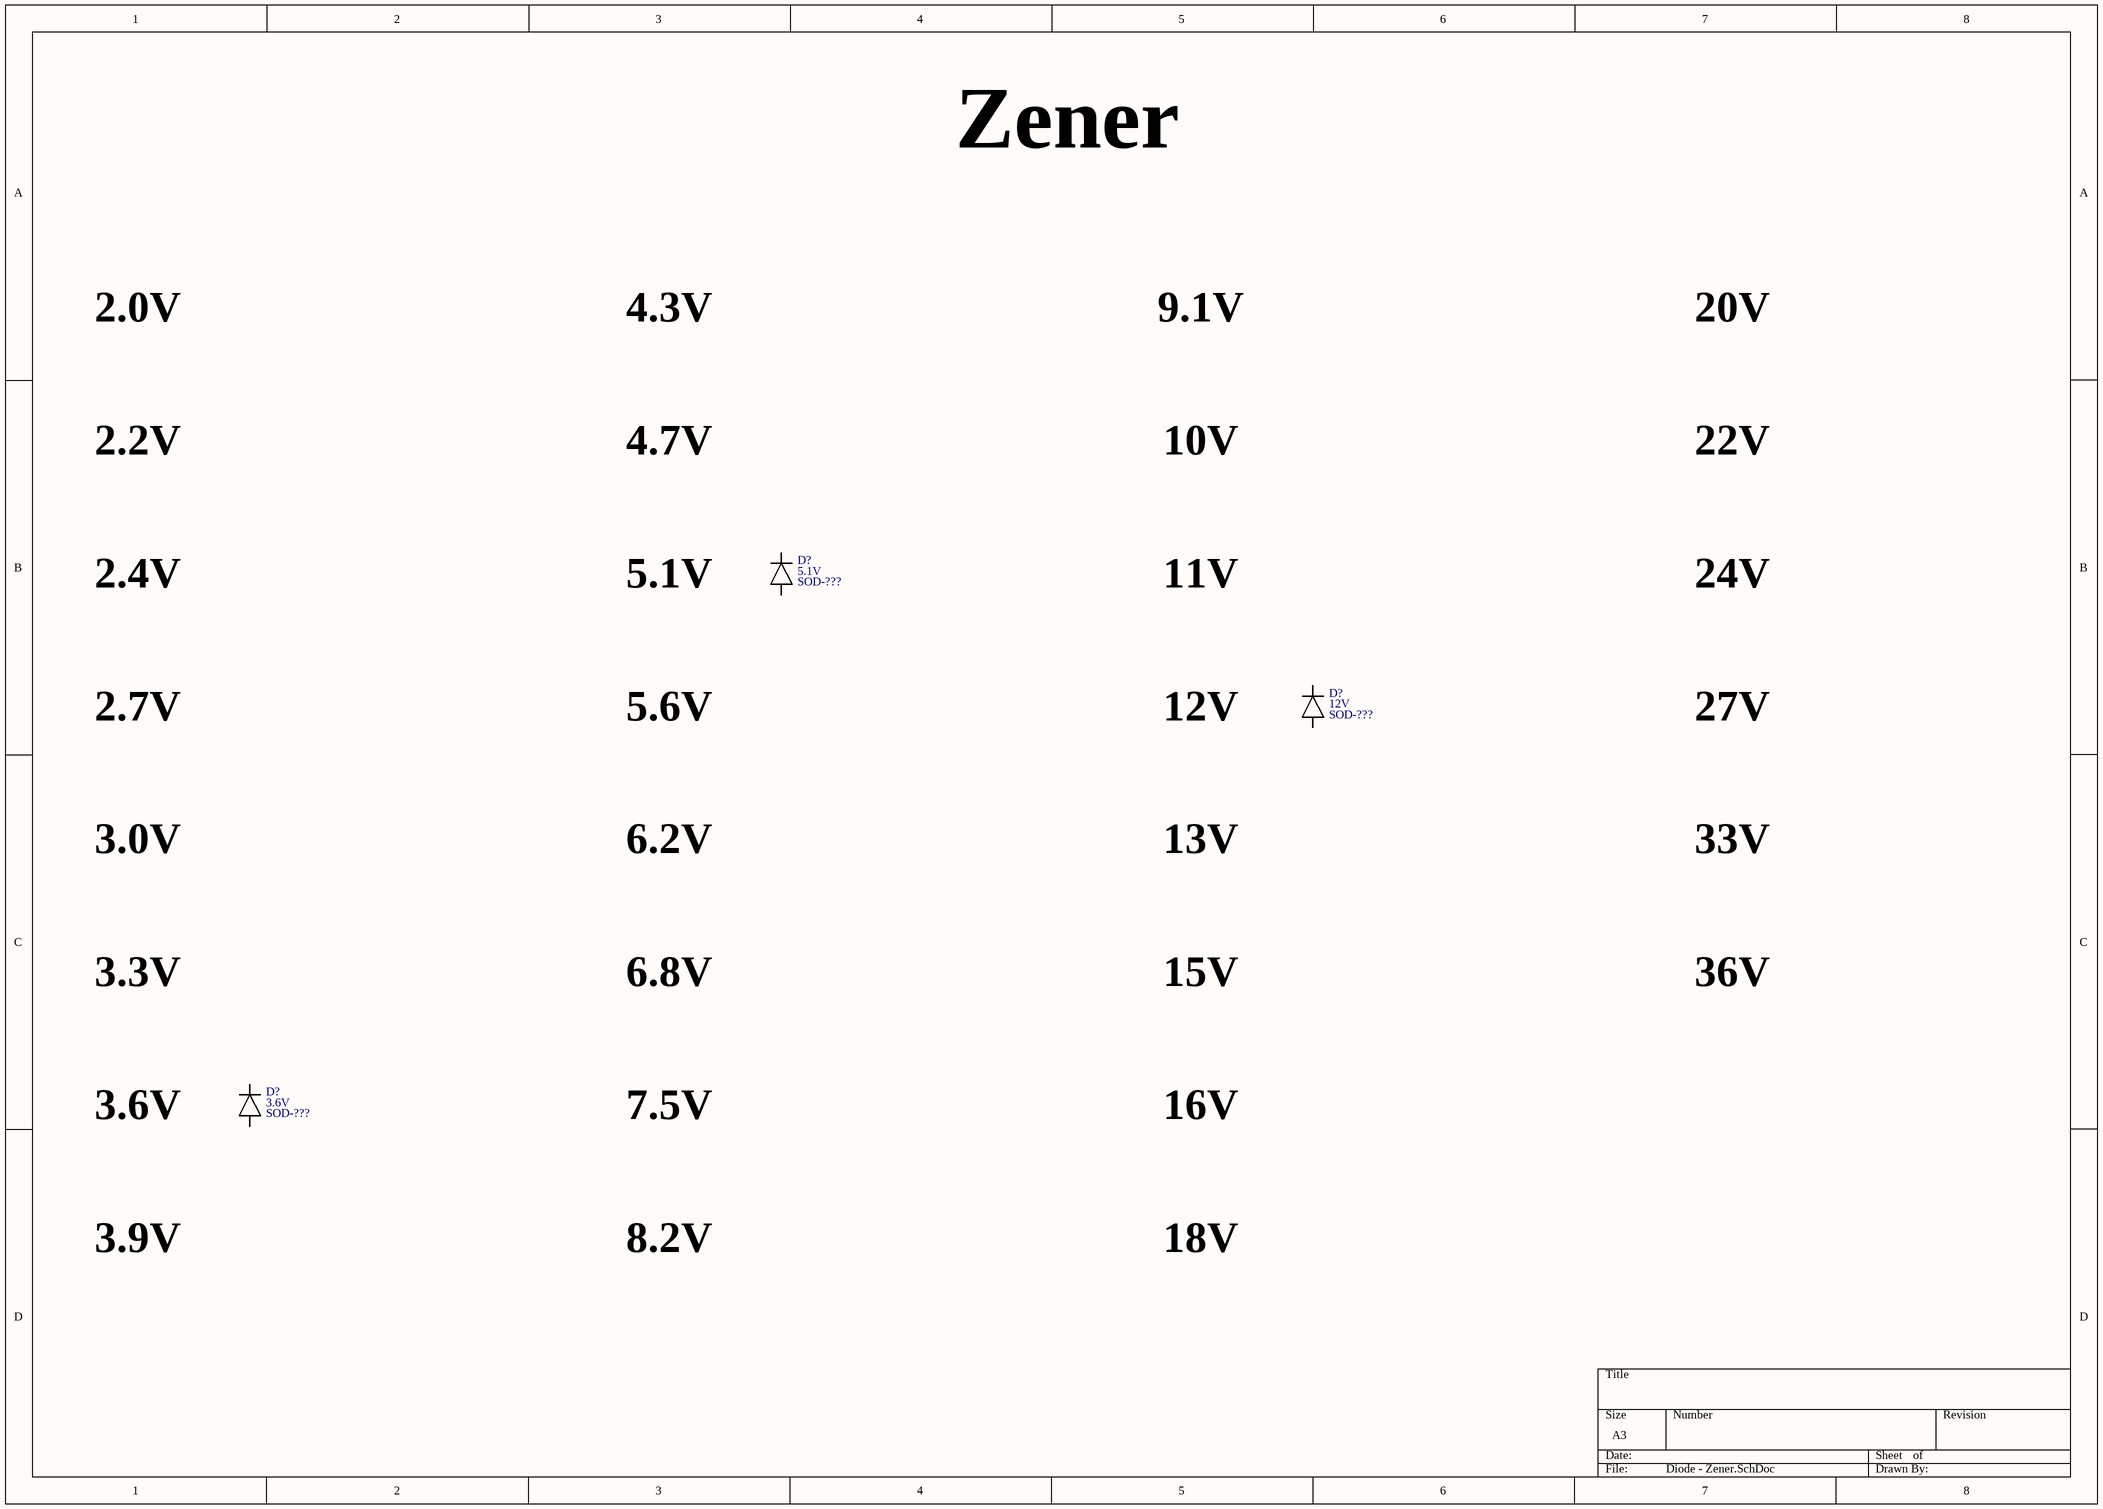
[diagram p59: Diode - Zener.SchDoc]

### Notes on the sheet
- Zener
- 2.0V
- 4.3V
- 9.1V
- 20V
- 2.2V
- 4.7V
- 10V
- 22V
- D?
- 5.1V
- SOD-???
- 2.4V
- 11V
- 24V
- 12V
- 2.7V
- 5.6V
- 27V
- 3.0V
- 6.2V
- 13V
- 33V
- 3.3V
- 6.8V
- 15V
- 36V
- 3.6V
- 7.5V
- 16V
- 3.9V
- 8.2V
- 18V

## Sheet Diode - Schottky.SchDoc
size A3; SheetNumber: 24; SheetTotal: 40
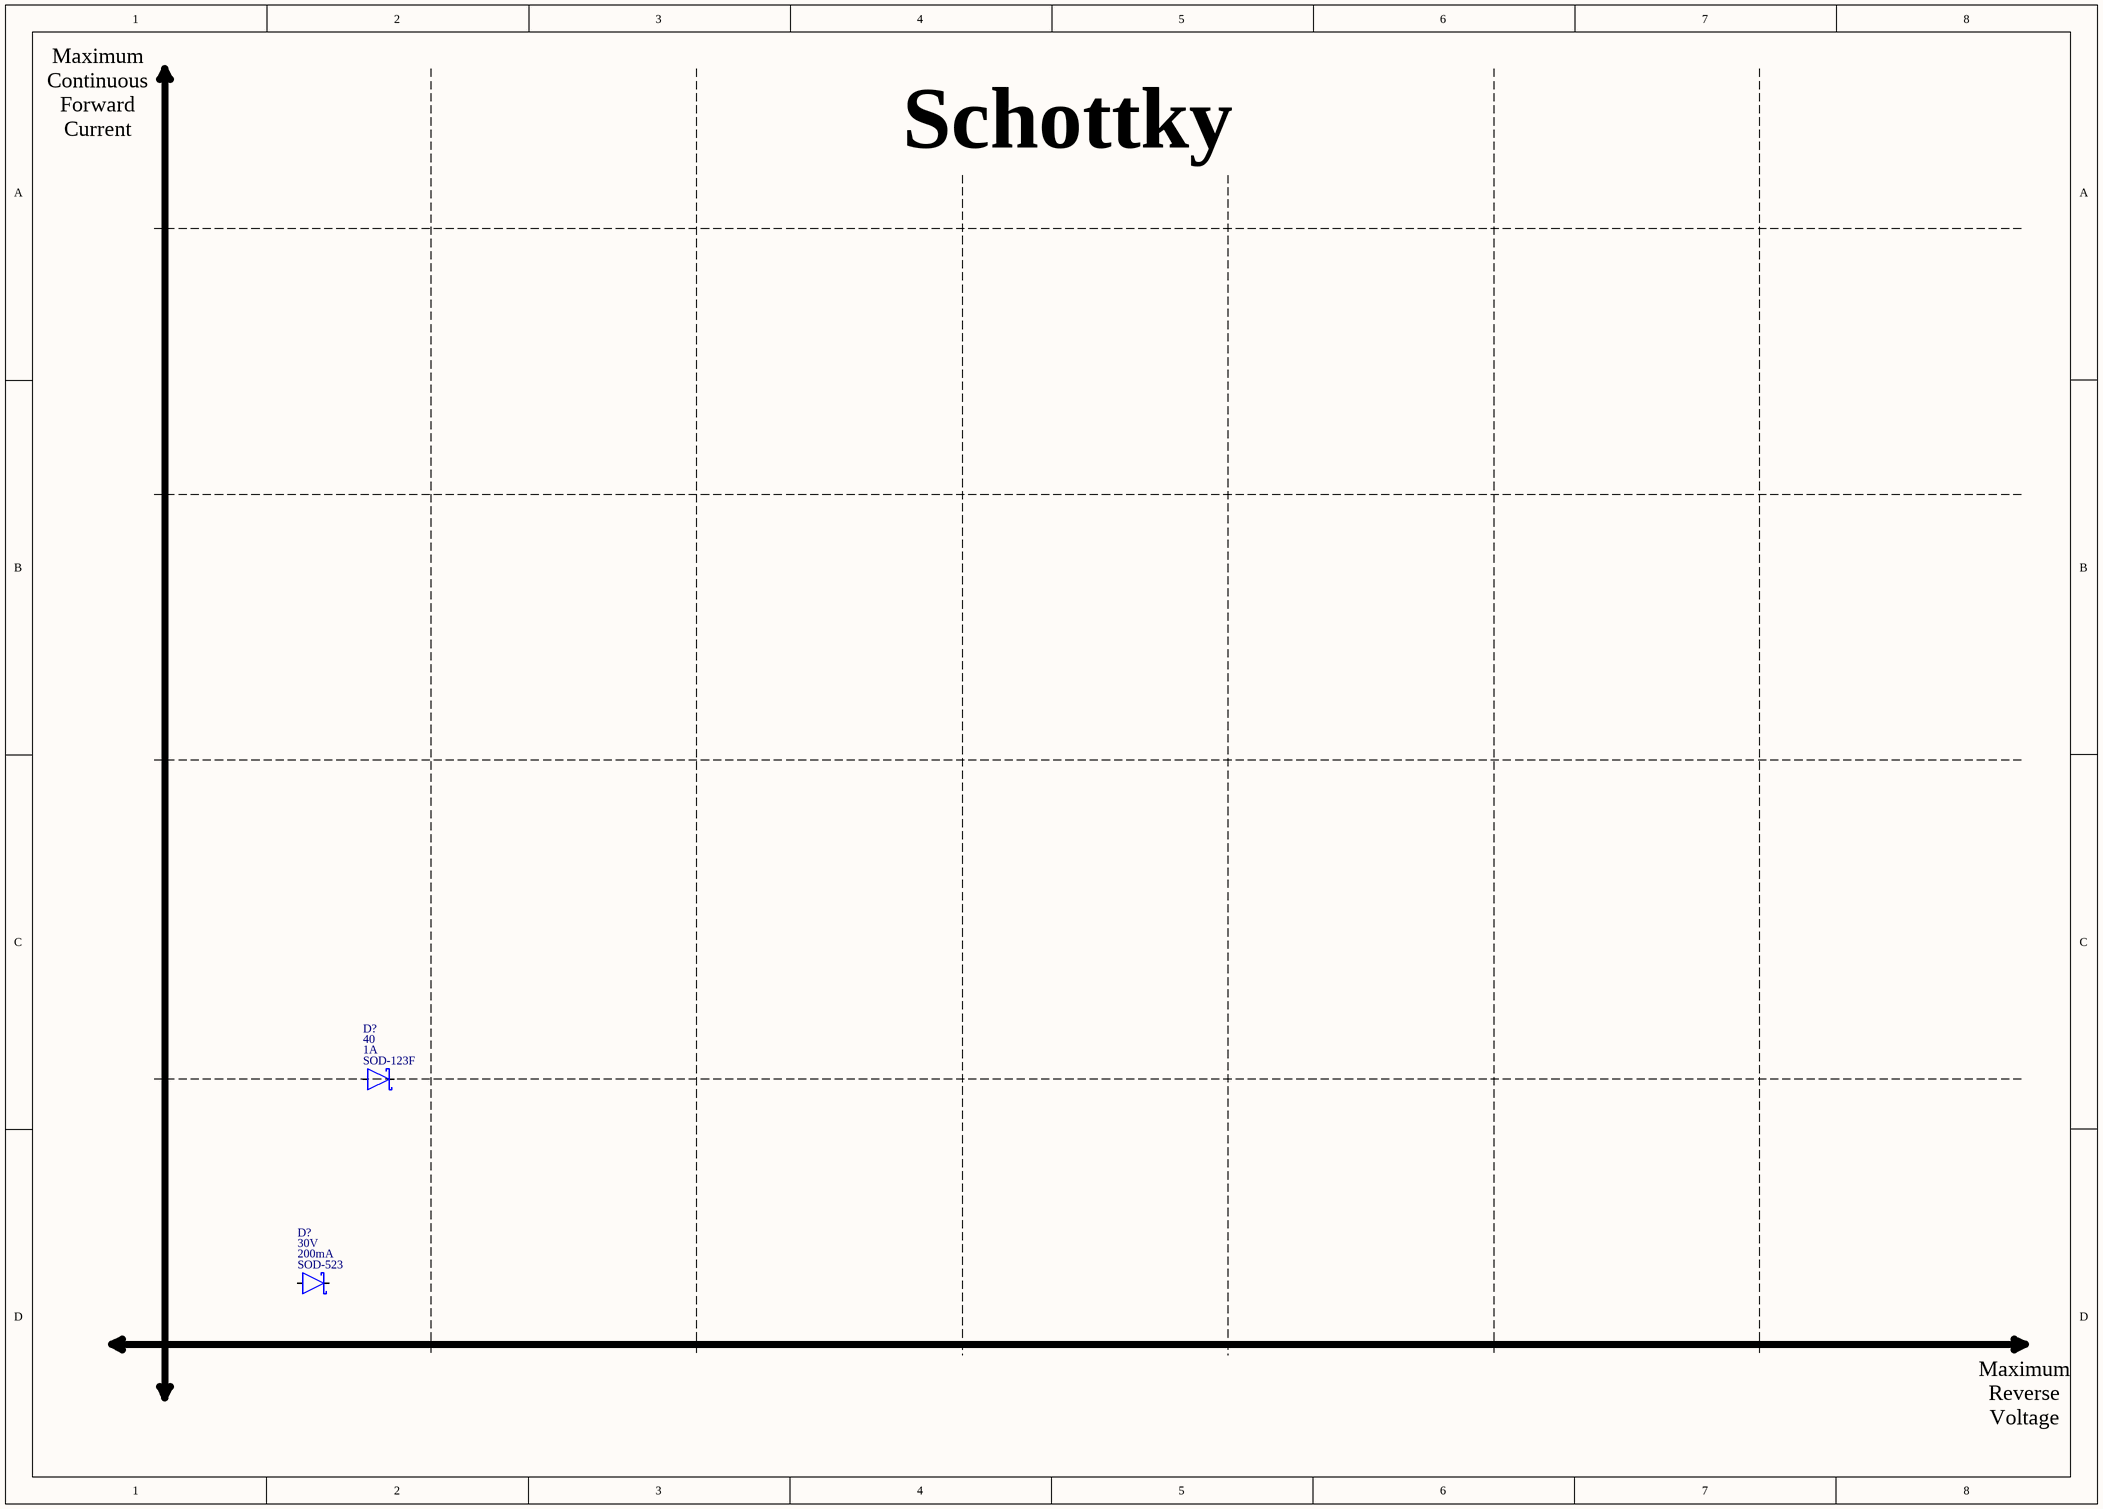
[diagram p60: Diode - Schottky.SchDoc]

### Parts
(Parts that share a designator on the sheet are numbered #1, #2 ... from top to bottom, then left to right.)
D?#1  Current: 1A  Voltage: 40  Package: SOD-123F  [Diode_SOD-123F]  (hidden comment: Diode_Schottky)
D?#2  Current: 200mA  Voltage: 30V  Package: SOD-523  [Diode_SOD-523_SC-79]  (hidden comment: Diode_Schottky)

### Nets

Not connected (* = marked no-connect by the designer): D?#1 A C; D?#2 A C

### Notes on the sheet
- Maximum
  Continuous
  Forward
  Current
- Schottky
- 1000A
- 100A
- 10A
- 1A
- 50V
- 100V
- 200V
- 400V
- 800V
- 1600V
- Maximum
  Reverse
  Voltage

### Library data of the parts
D?#1 = Diode_Schottky: Diode, Schottky, 40V, 1A, SOD-123F; Manufacturer Part Number: RB162MM-40TR; Manufacturer: Rohm; ComponentLink1Description: Datasheet; ComponentLink1URL: E:\Altium\Datasheets\Diode\Rohm, RB162MM-40.pdf; ComponentLink2Description: Supplier Link; ComponentLink2URL: https://www.digikey.com/en/products/detail/rohm-semiconductor/RB162MM-40TR/5001868; Supplier: Digikey; Supplier Part Number: RB162MM-40CT-ND; Operating Temperature, Min: ---℃; Operating Temperature, Max: +150℃; Quantity, Min: 1; Quantity, Max: 75000; Price, Min: 0.04; Price, Max: 0.0525; Supplier Currency: $; Supplier Link: https://www.digikey.com/en/products/detail/rohm-semiconductor/RB162MM-40TR/5001868; Component Type: Schottky; Component Category: Diode
D?#2 = Diode_Schottky: Diode, Schottky, 30V, 200mA, SOD-523; Manufacturer Part Number: CES521,L3F; Manufacturer: Toshiba; ComponentLink1Description: Datasheet; ComponentLink1URL: E:\Altium\Datasheets\Diode\Toshiba, CES521.pdf; ComponentLink2Description: Supplier Link; ComponentLink2URL: https://www.digikey.com/en/products/detail/toshiba-semiconductor-and-storage/CES521-L3F/3522356; Supplier: Digikey; Supplier Part Number: CES521L3FCT-ND; Operating Temperature, Min: ---℃; Operating Temperature, Max: +125℃; Quantity, Min: 1; Quantity, Max: 200000; Price, Min: 0.18; Price, Max: 0.018; Supplier Currency: $; Supplier Link: https://www.digikey.com/en/products/detail/toshiba-semiconductor-and-storage/CES521-L3F/3522356; Component Type: Schottky; Component Category: Diode

## Sheet Diode - TVS.SchDoc
size A3; SheetNumber: 25; SheetTotal: 40
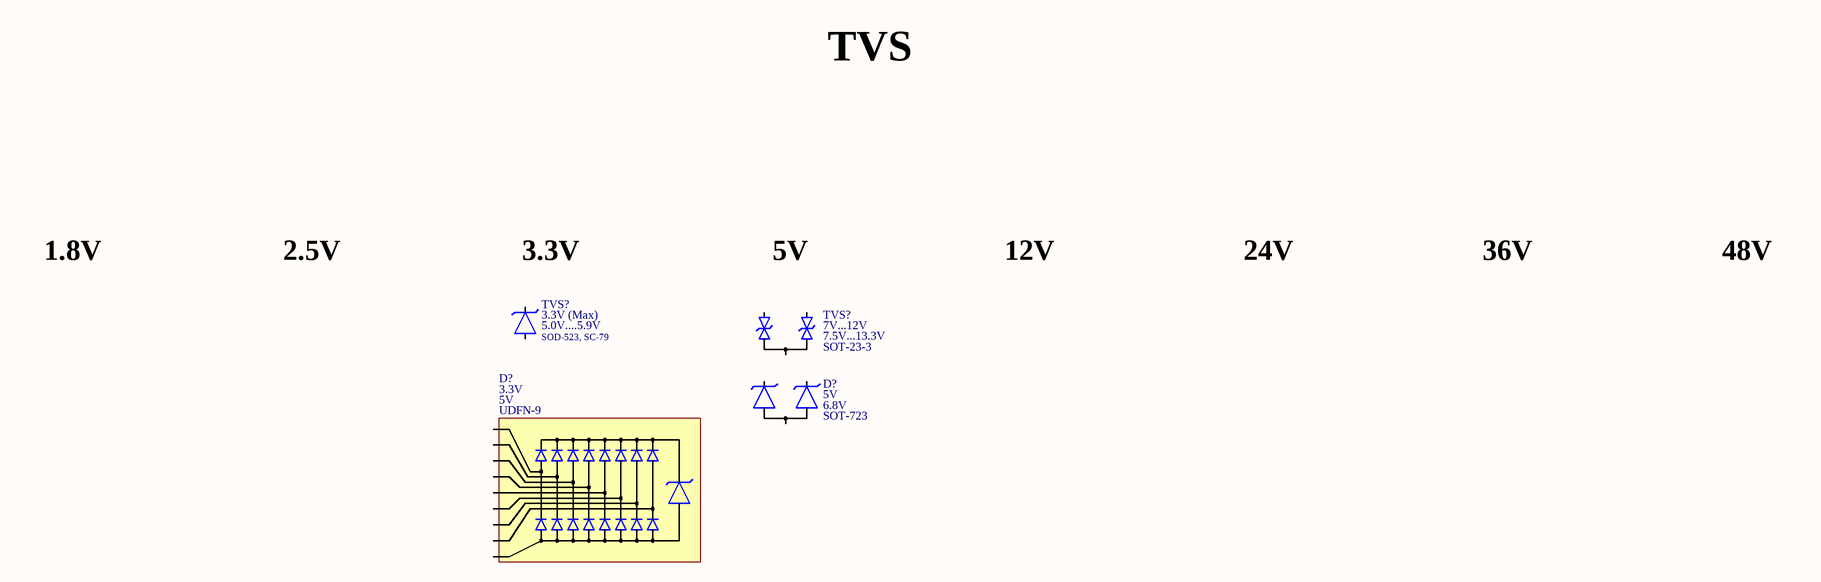
[diagram p61: Diode - TVS.SchDoc]

### Parts
(Parts that share a designator on the sheet are numbered #1, #2 ... from top to bottom, then left to right.)
D?#3  Voltage, Break Down: 5V  Voltage, Stand Off: 3.3V  Package: UDFN-9  [Diode_Tvs_9P_Common_Anode - Diodes, DT1240A-08LP3810-7]  (hidden comment: Diode_Tvs_9P_Common_Anode - Diodes, DT1240A-08LP3810-7)
D?#4  Voltage, Break Down: 6.8V  Voltage, Stand Off: 5V  Package: SOT-723  [Diode_SOT-723_2P_Common_Anode_Type_1]  (hidden comment: Diode_Tvs_2P_Common_Anode)
TVS?#1  Voltage, Break Down: 5.0V....5.9V  Voltage, Stand Off: 3.3V (Max)  Package: SOD-523, SC-79  [Diode_SOD-523_SC-79]  (hidden comment: Diode_Tvs)
TVS?#2  Voltage, Break Down: 7.5V...13.3V  Voltage, Stand Off: 7V...12V  Package: SOT-23-3  [Diode_SOT-23-3_2P_Bidirectional_Type_1]  (hidden comment: Diode_Tvs_2P_Bidirectional)

### Nets

Not connected (* = marked no-connect by the designer): D?#3 1 2 3 4 5 6 7 8 9; D?#4 A C1 C2; TVS?#1 A C; TVS?#2 Common D1 D2

### Notes on the sheet
- TVS
- 1.8V
- 2.5V
- (near TVS?#1) 3.3V
- (near TVS?#2) 5V
- 12V
- 24V
- 36V
- 48V

### Library data of the parts
D?#3 = Diode_Tvs_9P_Common_Anode - Diodes, DT1240A-08LP3810-7: Component Category: Diode; ComponentLink1Description: Datasheet; ComponentLink1URL: E:\Altium\Datasheets\Diode\Diodes, DT1240A-08LP3810-7.pdf; ComponentLink2Description: Supplier Link; ComponentLink2URL: https://www.digikey.com/en/products/detail/diodes-incorporated/dt1240a-08lp3810-7/8255867; Manufacturer Part Number: DT1240A-08LP3810-7; Supplier: Digikey; Supplier Part Number: DT1240A-08LP3810-7DICT-ND; Manufacturer: Diodes; Operating Temperature, Min: -55℃; Operating Temperature, Max: +86℃; Quantity, Min: 1; Quantity, Max: 2500; Price, Min: 0.10245; Price, Max: 0.42; Supplier Currency: $; Supplier Link: https://www.digikey.com/en/products/detail/diodes-incorporated/dt1240a-08lp3810-7/8255867; Component Type: TVS
D?#4 = Diode_Tvs_2P_Common_Anode: Diode, TVS, 5V/6.8V, SOD-723; Manufacturer Part Number: DF3A6.8LFV,L3F; Manufacturer: Toshiba; ComponentLink1Description: Datasheet; ComponentLink1URL: E:\Altium\Datasheets\Diode\Toshiba, DF3A6.8LFV.pdf; ComponentLink2Description: Supplier Link; ComponentLink2URL: https://www.digikey.com/en/products/detail/toshiba-semiconductor-and-storage/DF3A6-8LFV-L3F/4305070; Supplier: Digikey; Supplier Part Number: DF3A6.8LFVL3FCT-ND; Operating Temperature, Min: ---℃; Operating Temperature, Max: ---℃; Quantity, Min: 1; Quantity, Max: 200000; Price, Min: 0.25; Price, Max: 0.027; Supplier Currency: $; Supplier Link: https://www.digikey.com/en/products/detail/toshiba-semiconductor-and-storage/DF3A6-8LFV-L3F/4305070; Component Type: Tvs; Component Category: Diode
TVS?#1 = Diode_Tvs: Manufacturer Part Number: CESD3V3D5; Manufacturer: SMC; Component Category: Diode; ComponentLink1Description: Datasheet; ComponentLink1URL: E:\Altium\Datasheets\Diode\SMC, CESDxxxD5.pdf; ComponentLink2Description: Supplier Link; ComponentLink2URL: https://www.digikey.com/en/products/detail/smc-diode-solutions/CESD3V3D5/16584901; Supplier: Digikey; Supplier Part Number: 1655-CESD3V3D5CT-ND; Operating Temperature, Min: -55℃; Operating Temperature, Max: +150℃; Quantity, Min: 1; Quantity, Max: 8000; Price, Min: 0.1; Price, Max: 0.02386; Supplier Currency: $; Supplier Link: https://www.digikey.com/en/products/detail/smc-diode-solutions/CESD3V3D5/16584901; Component Type: Zener
TVS?#2 = Diode_Tvs_2P_Bidirectional: TVS, 2P, Bidirectional, 7V/12V, SOT-23-3; Manufacturer Part Number: CDSOT23-SM712; Manufacturer: Bourns; Component Category: Diode; ComponentLink1Description: Datasheet; ComponentLink1URL: E:\Altium\Datasheets\Diode\Bourns, CDSOT23-SM712.pdf; ComponentLink2Description: Supplier Link; ComponentLink2URL: https://www.digikey.com/en/products/detail/bourns-inc/CDSOT23-SM712/1630592; Supplier: Digikey; Supplier Part Number: CDSOT23-SM712CT-ND; Operating Temperature, Min: -55℃; Operating Temperature, Max: +150℃; Quantity, Min: 1; Quantity, Max: 3000; Price, Min: 1.59; Price, Max: 0.675; Supplier Currency: $; Supplier Link: https://www.digikey.com/en/products/detail/bourns-inc/CDSOT23-SM712/1630592; Component Type: TVS

## Sheet Diode - Led.SchDoc
size A3; SheetNumber: 27; SheetTotal: 41
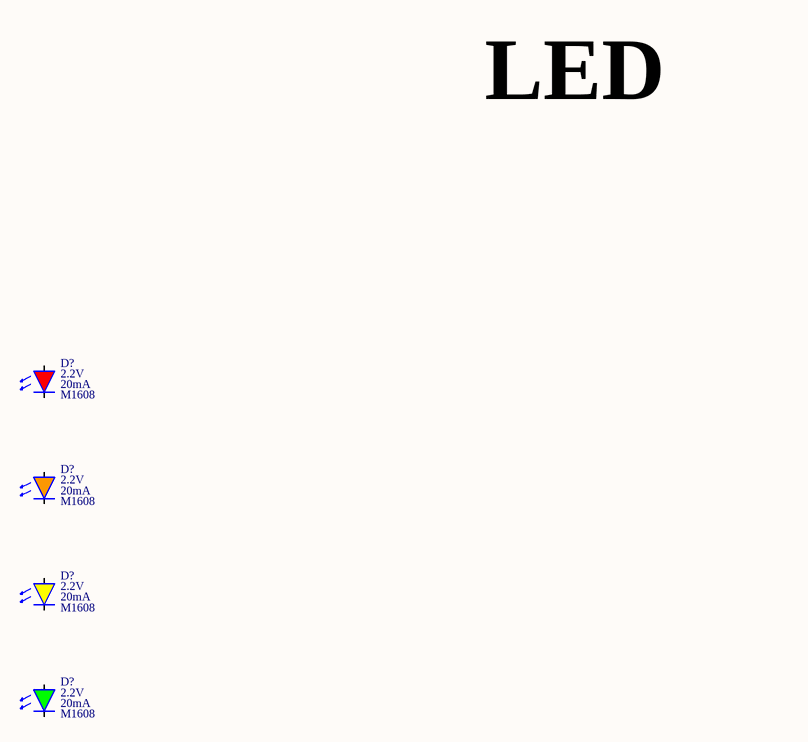
[diagram p62: Diode - Led.SchDoc]

### Parts
(Parts that share a designator on the sheet are numbered #1, #2 ... from top to bottom, then left to right.)
D?#5  Current: 20mA  Voltage: 2.2V  Package: M1608  [Diode_Smd_M1608_I0603_Red]  (hidden comment: Diode_Led)
D?#6  Current: 20mA  Voltage: 2.2V  Package: M1608  [Diode_Smd_M1608_I0603_Orange1]  (hidden comment: Diode_Led)
D?#7  Current: 20mA  Voltage: 2.2V  Package: M1608  [Diode_Smd_M1608_I0603_Yellow]  (hidden comment: Diode_Led)
D?#8  Current: 20mA  Voltage: 2.2V  Package: M1608  [Diode_Smd_M1608_I0603_Green-Yellow]  (hidden comment: Diode_Led)

### Nets

Not connected (* = marked no-connect by the designer): D?#5 A C; D?#6 A C; D?#7 A C; D?#8 A C

### Notes on the sheet
- LED

### Library data of the parts
D?#5 = Diode_Led: Diode, Led, Red, 2.2V, 20mA, M1608; Manufacturer Part Number: SML-D12U1WT86; Manufacturer: Rohm; ComponentLink1Description: Datasheet; ComponentLink1URL: E:\Altium\Datasheets\Diode\Rohm, SML-D12x1 Series.pdf; ComponentLink2Description: Supplier Link; ComponentLink2URL: https://www.digikey.com/en/products/detail/rohm-semiconductor/SML-D12U1WT86/5843853; Supplier: Digikey; Supplier Part Number: SML-D12U1WT86CT-ND; Operating Temperature, Min: -40℃; Operating Temperature, Max: +85℃; Quantity, Min: 1; Quantity, Max: 75000; Price, Min: 0.25; Price, Max: 0.02838; Supplier Currency: $; Supplier Link: https://www.digikey.com/en/products/detail/rohm-semiconductor/SML-D12U1WT86/5843853; Component Type: Led; Component Category: Diode
D?#6 = Diode_Led: Diode, Led, Orange, 2.2V, 20mA, M1608; Manufacturer Part Number: SML-D12D1WT86; Manufacturer: Rohm; ComponentLink1Description: Datasheet; ComponentLink1URL: E:\Altium\Datasheets\Diode\Rohm, SML-D12x1 Series.pdf; ComponentLink2Description: Supplier Link; ComponentLink2URL: https://www.digikey.com/en/products/detail/rohm-semiconductor/SML-D12D1WT86/5843854; Supplier: Digikey; Supplier Part Number: SML-D12D1WT86CT-ND; Operating Temperature, Min: -40℃; Operating Temperature, Max: +85℃; Quantity, Min: 1; Quantity, Max: 75000; Price, Min: 0.25; Price, Max: 0.02838; Supplier Currency: $; Supplier Link: https://www.digikey.com/en/products/detail/rohm-semiconductor/SML-D12D1WT86/5843854; Component Type: Led; Component Category: Diode
D?#7 = Diode_Led: Diode, Led, Yellow, 2.2V, 20mA, M1608; Manufacturer Part Number: SML-D12Y1WT86; Manufacturer: Rohm; ComponentLink1Description: Datasheet; ComponentLink1URL: E:\Altium\Datasheets\Diode\Rohm, SML-D12x1 Series.pdf; ComponentLink2Description: Supplier Link; ComponentLink2URL: https://www.digikey.com/en/products/detail/rohm-semiconductor/SML-D12Y1WT86/5843855; Supplier: Digikey; Supplier Part Number: SML-D12Y1WT86CT-ND; Operating Temperature, Min: -40℃; Operating Temperature, Max: +85℃; Quantity, Min: 1; Quantity, Max: 75000; Price, Min: 0.25; Price, Max: 0.02838; Supplier Currency: $; Supplier Link: https://www.digikey.com/en/products/detail/rohm-semiconductor/SML-D12Y1WT86/5843855; Component Type: Led; Component Category: Diode
D?#8 = Diode_Led: Diode, Led, Green-Yellow, 2.2V, 20mA, M1608; Manufacturer Part Number: SML-D12M1WT86; Manufacturer: Rohm; ComponentLink1Description: Datasheet; ComponentLink1URL: E:\Altium\Datasheets\Diode\Rohm, SML-D12x1 Series.pdf; ComponentLink2Description: Supplier Link; ComponentLink2URL: https://www.digikey.com/en/products/detail/rohm-semiconductor/SML-D12M1WT86/5843856; Supplier: Digikey; Supplier Part Number: SML-D12M1WT86CT-ND; Operating Temperature, Min: -40℃; Operating Temperature, Max: +85℃; Quantity, Min: 1; Quantity, Max: 75000; Price, Min: 0.25; Price, Max: 0.02838; Supplier Currency: $; Supplier Link: https://www.digikey.com/en/products/detail/rohm-semiconductor/SML-D12M1WT86/5843856; Component Type: Led; Component Category: Diode

## Sheet Crystal.SchDoc
size A3; SheetNumber: 16; SheetTotal: 25
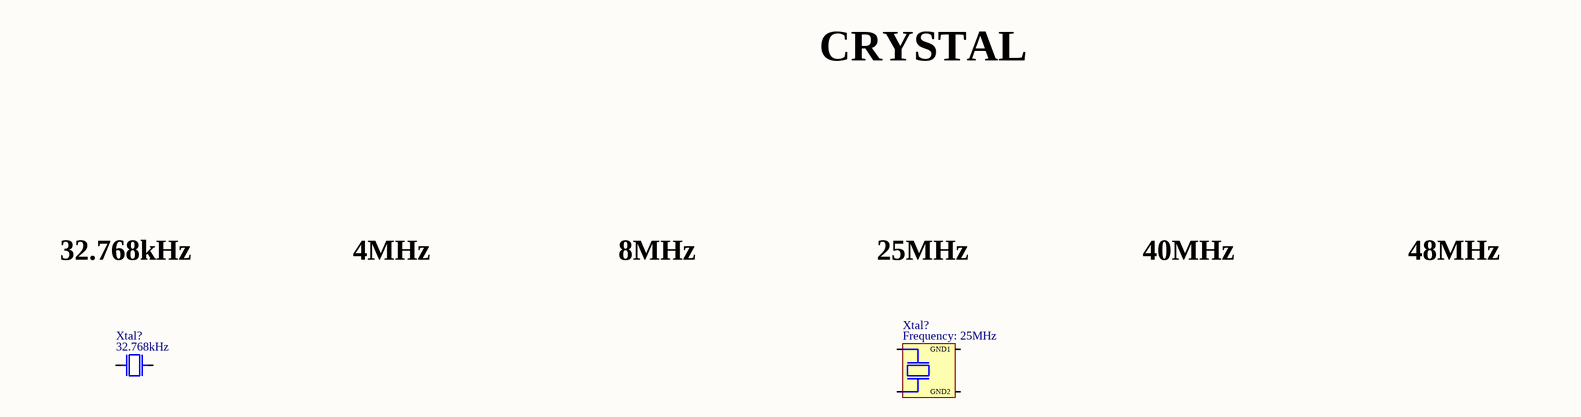
[diagram p63: Crystal.SchDoc]

### Parts
(Parts that share a designator on the sheet are numbered #1, #2 ... from top to bottom, then left to right.)
Xtal?#1  Frequency: 25MHz  [Kyocera, CX3225SB]  (hidden comment: Crystal, Two Gnd Pins)
Xtal?#2  Frequency: 32.768kHz  [NDK, NX3215SA]  (hidden comment: Crystal)

### Nets

Not connected (* = marked no-connect by the designer): Xtal?#1 1 2 GND1 GND2; Xtal?#2 1 2

### Notes on the sheet
- CRYSTAL
- 32.768kHz
- 4MHz
- 8MHz
- 25MHz
- 40MHz
- 48MHz

### Library data of the parts
Xtal?#1 = Crystal, Two Gnd Pins: XTAL, 25MHz, 12pF; Manufacturer: Kyocera; Manufacturer Part Number: CX3225SB25000H0FLJCC; ComponentLink1Description: Datasheet; ComponentLink1URL: E:\Altium\Datasheets\Crystal\Kyocera, CX3225SB.pdf; ComponentLink2Description: Supplier Link; ComponentLink2URL: https://www.digikey.com/en/products/detail/kyocera-avx/cx3225sb25000h0fljcc/6123312; Supplier: Digikey; Supplier Part Number: 478-CX3225SB25000H0FLJCCCT-ND; Operating Temperature, Min: -30℃; Operating Temperature, Max: +85℃; Quantity, Min: 1; Quantity, Max: 15000; Price, Min: 0.66; Supplier Currency: $; Price, Max: 0.34087; Supplier Link: https://www.digikey.com/en/products/detail/kyocera-avx/cx3225sb25000h0fljcc/6123312; Component Type: Crystal; Component Category: Crystal; Package: SMD
Xtal?#2 = Crystal: XTAL, 32.768kHz, 12.5pF; Manufacturer: NDK; Manufacturer Part Number: NX3215SA-32.768K-STD-MUS-2; ComponentLink1Description: Datasheet; ComponentLink1URL: E:\Altium\Datasheets\Crystal\NDK, NX3215SA.pdf; ComponentLink2Description: Supplier Link; ComponentLink2URL: https://www.digikey.com/en/products/detail/ndk-america-inc/NX3215SA-32-768K-STD-MUS-2/2349033; Supplier: Digikey; Supplier Part Number: 644-1159-1-ND; Operating Temperature, Min: -40℃; Operating Temperature, Max: +125℃; Quantity, Min: 1; Quantity, Max: 15000; Price, Min: 0.74; Supplier Currency: $; Price, Max: 0.3432; Supplier Link: https://www.digikey.com/en/products/detail/ndk-america-inc/NX3215SA-32-768K-STD-MUS-2/2349033; Component Type: Crystal; Component Category: Crystal; Package: SMD